# Altium project Armadeus.PrjPCB
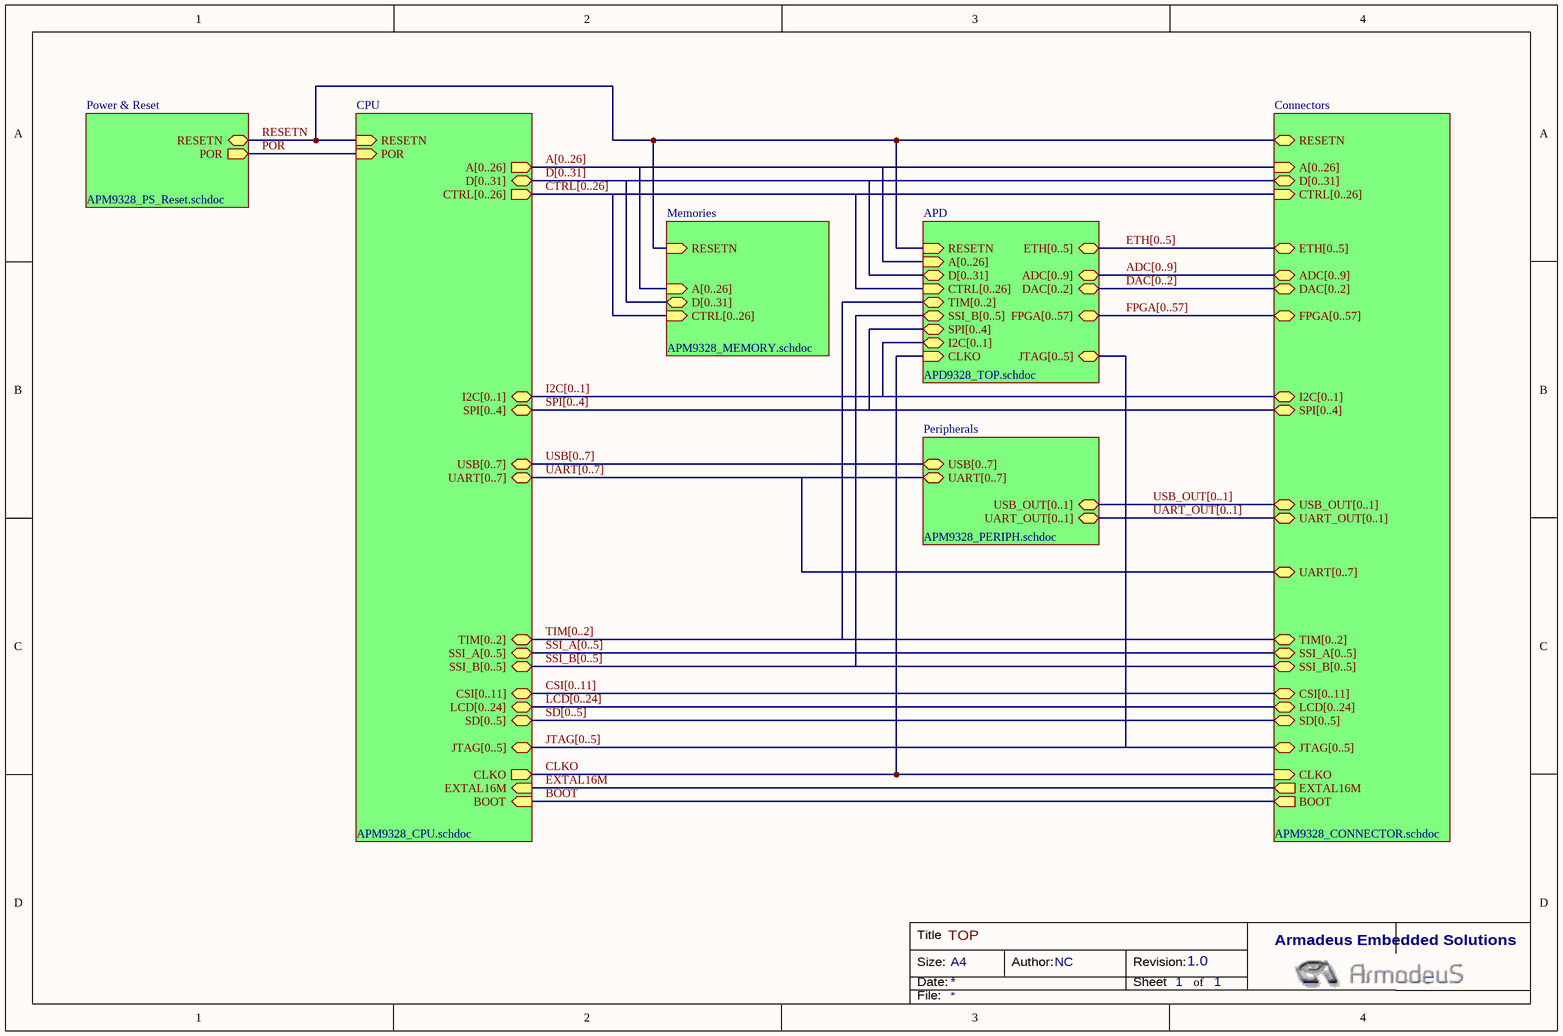
[diagram p0: APM9328_TOP.SchDoc]
10 sheets, 55 parts. Net scope: hierarchical (ports join the sheet entries above them; power ports are global).
Board file: Armadeus.PcbDoc
Sheets:
  APM9328_TOP.SchDoc
    Power & Reset = APM9328_PS_Reset.SchDoc
    CPU = APM9328_CPU.SchDoc
    Peripherals = APM9328_PERIPH.SchDoc
    Connectors = APM9328_CONNECTOR.SchDoc
      RIGHT_CONNECTOR = APM9328_CONNECTORR.SchDoc
      LEFT_CONNECTOR = APM9328_CONNECTORL.SchDoc
    APD = APD9328_TOP.SchDoc
      FPGA = APD9328_FPGA.SchDoc
      ANALOG = APD9328_ANALOG.SchDoc

## Sheet APM9328_TOP.SchDoc: TOP
size A4; Author: NC; Revision: 1.0; SheetNumber: 1; SheetTotal: 1

### Sub-sheets
APD = APD9328_TOP.schdoc: RESETN (in), A[0..26] (in), D[0..31] (bidir), CTRL[0..26] (in), ETH[0..5] (bidir), ADC[0..9] (bidir), DAC[0..2] (bidir), FPGA[0..57] (bidir), I2C[0..1] (bidir), SPI[0..4] (bidir), CLKO (in), SSI_B[0..5] (bidir), TIM[0..2] (bidir), JTAG[0..5] (bidir)
Connectors = APM9328_CONNECTOR.schdoc: UART[0..7] (bidir), UART_OUT[0..1] (bidir), USB_OUT[0..1] (bidir), A[0..26] (in), D[0..31] (bidir), CTRL[0..26] (in), TIM[0..2] (bidir), I2C[0..1] (bidir), SPI[0..4] (bidir), SSI_A[0..5] (bidir), SSI_B[0..5] (bidir), CSI[0..11] (bidir), LCD[0..24] (bidir), SD[0..5] (bidir), JTAG[0..5] (bidir), CLKO (in), EXTAL16M (out), BOOT (out), RESETN (bidir), ETH[0..5] (bidir), ADC[0..9] (bidir), DAC[0..2] (bidir), FPGA[0..57] (bidir)
CPU = APM9328_CPU.schdoc: A[0..26] (out), BOOT (in), CLKO (out), CSI[0..11] (bidir), CTRL[0..26] (out), D[0..31] (bidir), EXTAL16M (in), I2C[0..1] (bidir), JTAG[0..5] (bidir), LCD[0..24] (bidir), RESETN (in), POR (in), SD[0..5] (bidir), SPI[0..4] (bidir), SSI_A[0..5] (bidir), SSI_B[0..5] (bidir), TIM[0..2] (bidir), UART[0..7] (bidir), USB[0..7] (bidir)
Memories = APM9328_MEMORY.schdoc (file not in this document): A[0..26] (in), CTRL[0..26] (in), D[0..31] (bidir), RESETN (in)
Peripherals = APM9328_PERIPH.schdoc: UART[0..7] (bidir), UART_OUT[0..1] (bidir), USB[0..7] (bidir), USB_OUT[0..1] (bidir)
Power & Reset = APM9328_PS_Reset.schdoc: POR (out), RESETN (bidir)

### Nets
BOOT: sheet CPU/BOOT, sheet Connectors/BOOT
CLKO: sheet CPU/CLKO, sheet Connectors/CLKO, sheet APD/CLKO
EXTAL16M: sheet CPU/EXTAL16M, sheet Connectors/EXTAL16M
POR: sheet Power & Reset/POR, sheet CPU/POR
RESETN: sheet Power & Reset/RESETN, sheet CPU/RESETN, sheet Memories/RESETN, sheet Connectors/RESETN, sheet APD/RESETN

### Buses and harness runs
bus A[0..26] = sheet APD/A[0..26] = sheet Connectors/A[0..26] = sheet CPU/A[0..26] = sheet Memories/A[0..26]
bus ADC[0..9] = sheet APD/ADC[0..9] = sheet Connectors/ADC[0..9]
bus CSI[0..11] = sheet Connectors/CSI[0..11] = sheet CPU/CSI[0..11]
bus CTRL[0..26] = sheet APD/CTRL[0..26] = sheet Connectors/CTRL[0..26] = sheet CPU/CTRL[0..26] = sheet Memories/CTRL[0..26]
bus D[0..31] = sheet APD/D[0..31] = sheet Connectors/D[0..31] = sheet CPU/D[0..31] = sheet Memories/D[0..31]
bus DAC[0..2] = sheet APD/DAC[0..2] = sheet Connectors/DAC[0..2]
bus ETH[0..5] = sheet APD/ETH[0..5] = sheet Connectors/ETH[0..5]
bus FPGA[0..57] = sheet APD/FPGA[0..57] = sheet Connectors/FPGA[0..57]
bus I2C[0..1] = sheet APD/I2C[0..1] = sheet Connectors/I2C[0..1] = sheet CPU/I2C[0..1]
bus JTAG[0..5] = sheet APD/JTAG[0..5] = sheet Connectors/JTAG[0..5] = sheet CPU/JTAG[0..5]
bus LCD[0..24] = sheet Connectors/LCD[0..24] = sheet CPU/LCD[0..24]
bus SD[0..5] = sheet Connectors/SD[0..5] = sheet CPU/SD[0..5]
bus SPI[0..4] = sheet APD/SPI[0..4] = sheet Connectors/SPI[0..4] = sheet CPU/SPI[0..4]
bus SSI_A[0..5] = sheet Connectors/SSI_A[0..5] = sheet CPU/SSI_A[0..5]
bus SSI_B[0..5] = sheet APD/SSI_B[0..5] = sheet Connectors/SSI_B[0..5] = sheet CPU/SSI_B[0..5]
bus TIM[0..2] = sheet APD/TIM[0..2] = sheet Connectors/TIM[0..2] = sheet CPU/TIM[0..2]
bus UART[0..7] = sheet Connectors/UART[0..7] = sheet CPU/UART[0..7] = sheet Peripherals/UART[0..7]
bus UART_OUT[0..1] = sheet Connectors/UART_OUT[0..1] = sheet Peripherals/UART_OUT[0..1]
bus USB[0..7] = sheet CPU/USB[0..7] = sheet Peripherals/USB[0..7]
bus USB_OUT[0..1] = sheet Connectors/USB_OUT[0..1] = sheet Peripherals/USB_OUT[0..1]

### Notes on the sheet
- Title
- Size:
- Date:
- A4
- Author:
- Revision:
- Sheet
- of
- Armadeus Embedded Solutions
- File:

## Sheet APM9328_PS_Reset.SchDoc: POWER SUPPLY & RESET
size A4; Author: NC; Revision: 1.0; SheetNumber: 2; SheetTotal: 14
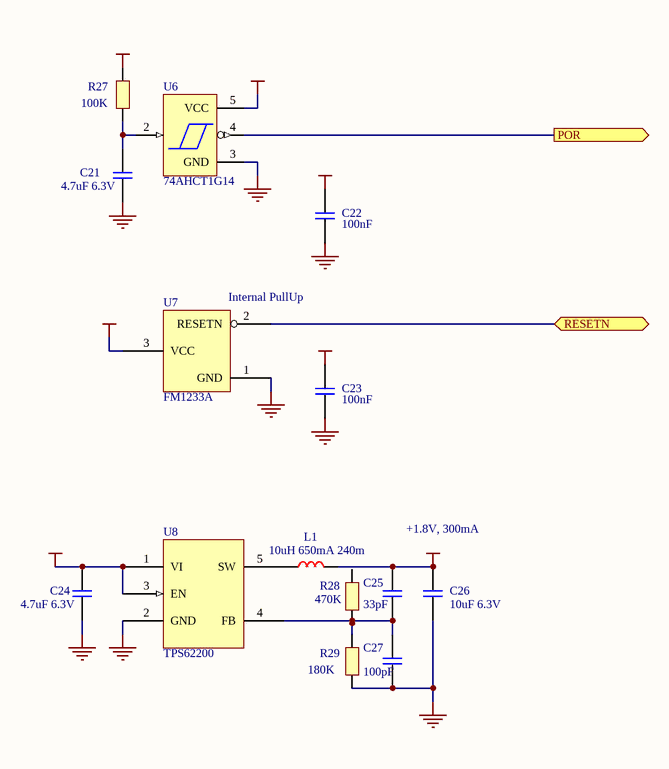
[diagram p1: APM9328_PS_Reset.SchDoc]

### Parts
C21  4.7uF 6.3V  [0805]
C22  100nF  [0402]
C23  100nF  [0402]
C24  4.7uF 6.3V  [0805]
C25  33pF  [0402]
C26  10uF 6.3V  [0805]
C27  100pF  [0402]
L1  10uH 650mA 240m  [Self_1812]
R27  100K  [0402]
R28  470K  [0402]
R29  180K  [0402]
U6  74AHCT1G14  [SC70-5]
U7  FM1233A  [SOT23-3]
U8  TPS62200  [SOT23-5]

### Ports
POR (out), RESETN (bidir)

### Nets
+1V8: C25.2 C26.2 L1.2
+3V3: C22.1 C23.1 C24.2 R27.2 U6.5(VCC) U7.3(VCC) U8.1(VI) U8.3(EN)
GND: C21.1 C22.2 C23.2 C24.1 C26.1 C27.1 R29.1 U6.3(GND) U7.1(GND) U8.2(GND)
POR: U6.4 ; port POR
RESETN: U7.2(RESETN) ; port RESETN
NetC21_2: C21.2 R27.1 U6.2
NetC25_1: C25.1 C27.2 R28.1 R29.2 U8.4(FB)
NetL1_1: L1.1 U8.5(SW)

Not connected (* = marked no-connect by the designer): R28 2; U6 1(NC)

### Notes on the sheet
- (near U7) Internal PullUp
- +1.8V, 300mA
- Title
- Size:
- Date:
- A4
- Author:
- Revision:
- Sheet
- of
- Armadeus Embedded Solutions
- File:

### Library data of the parts
C21 C24 = Cap: Ceramic Capacitor; Manufacturer: Kemet; Part Number: C0805C475K8PACTU; Distributor: Mouser
  C21: Price: *; Second Source: *; Assemby Option: *
  C24: Price_100: 0,3; Price_500: 0,11; Price_1000: 0,09
C22 C23 C25 C27 = Cap
C26 = Cap: Ceramic Capacitor; Manufacturer: *; Part Number: *; Distributor: *; Second Source: *; Price: *; Assembly Option: *
L1 = Self: Manufacturer: Murata; Part Number: LQH43CN100K03L; Distributor: Mouser; Price_100: 0,31; Price_500: 0,18; Price_1000: 0,17
R27 = Res: Manufacturer: KOA; Part Number: *; Distributor: Mouser; Price_100: 0,03; Price_500: 0,025; Price_1000: 0,02
R28 R29 = Res
U6 = 74AHCT1G14: Single Gate Inverter; Manufacturer: Texas Instrument; Part Number: SN74AHC1G14DCK; Second Source: NC7SV14 (Fairchild); Distributor: Digikey; Price_100: 0,216; Price_500: 0,126; Price_1000: 0,108
U7 = FM1233: Reset IC; Manufacturer: Fairchild; Part Number: FM1233ACS3X; Distributor: Mouser; Price_1000: 0,3; Price_500: 0,36; Price_100: 0,6
U8 = TPS62200: High Efficiency DC/DC converter; Manufacturer: Texas Instrument; Part Number: TPS62200DBV; Second Source: LM3670; Distributor: Digikey; Price_100: 1,68; Price_500: 1,56; Price_1000: 1,53

## Sheet APM9328_CPU.SchDoc
size A3; Organization: NetModule AG; Address1: Meriedweg 11; Address2: CH-3172 Niederwangen; Address4: Switzerland
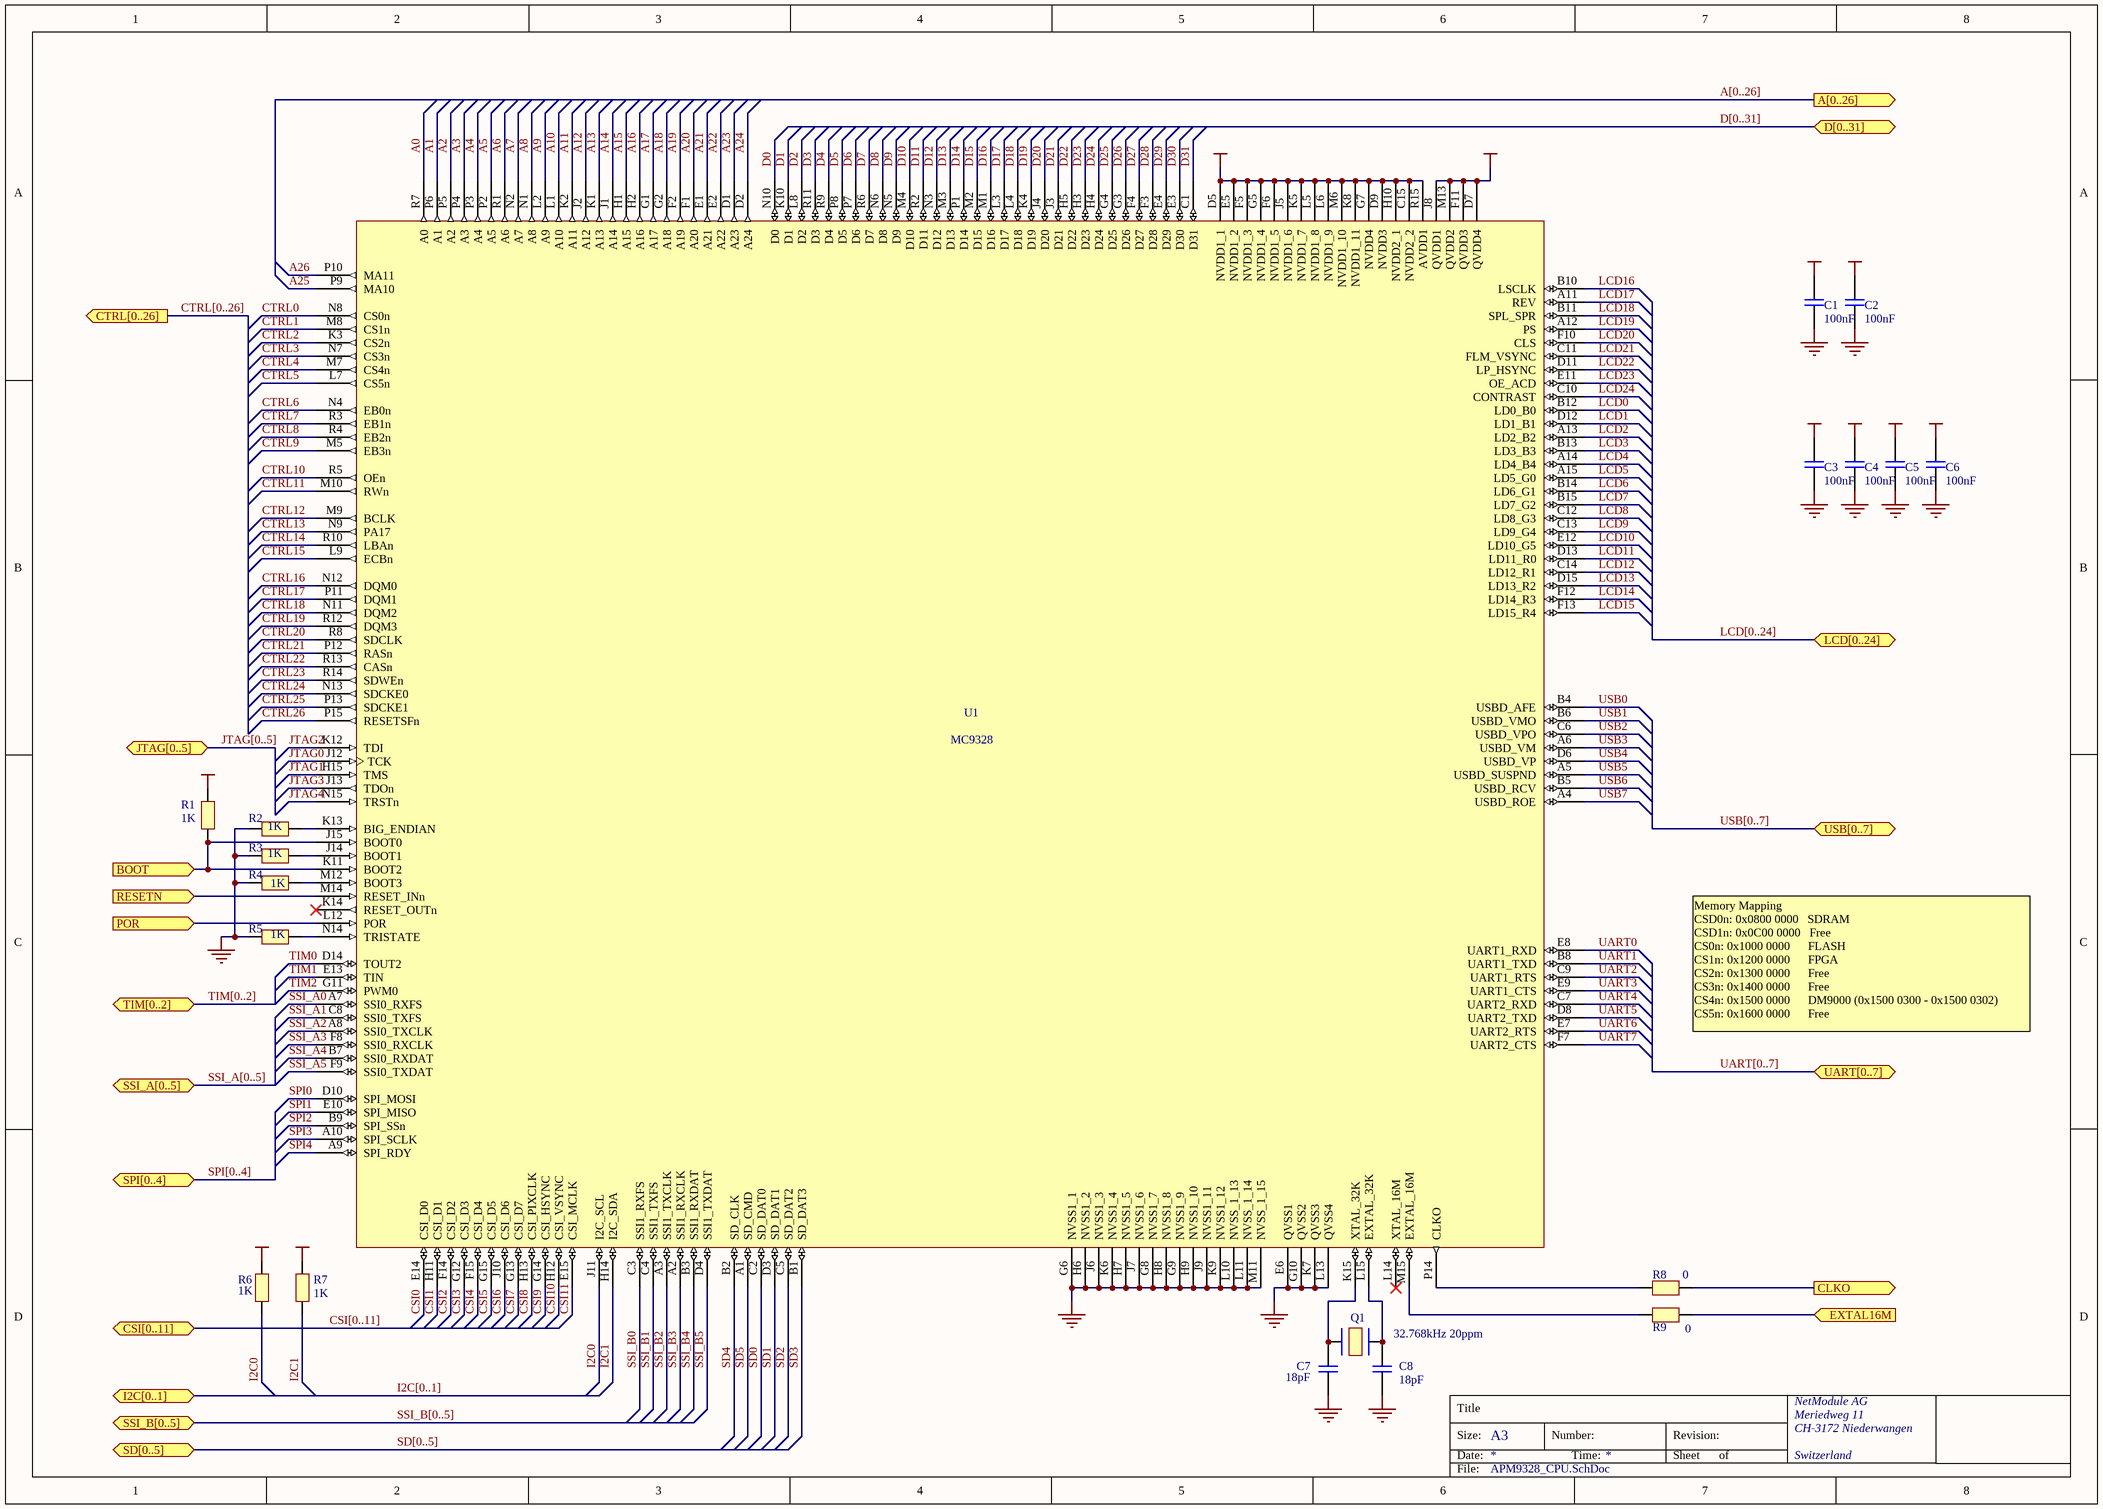
[diagram p2: APM9328_CPU.SchDoc]

### Parts
C1  100nF  [0402]
C2  100nF  [0402]
C3  100nF  [0402]
C4  100nF  [0402]
C5  100nF  [0402]
C6  100nF  [0402]
C7  18pF  [0402]
C8  18pF  [0402]
Q1  32.768kHz 20ppm  [Crystal_SMD_Cyl]
R1  1K  [0402]
R2  1K  [0402]
R3  1K  [0402]
R4  1K  [0402]
R5  1K  [0402]
R6  1K  [0402]
R7  1K  [0402]
R8  0  [0402]
R9  0  [0402]
U1  MC9328  [BGA225x15]

### Ports
A[0..26] (out), BOOT (in), CLKO (out), CSI[0..11] (bidir), CTRL[0..26] (out), D[0..31], EXTAL16M (in), I2C[0..1] (bidir), JTAG[0..5] (bidir), LCD[0..24] (bidir), POR (in), RESETN (in), SD[0..5], SPI[0..4], SSI_A[0..5] (bidir), SSI_B[0..5] (bidir), TIM[0..2], UART[0..7] (bidir), USB[0..7] (bidir)

### Nets
+1V8: C1.2 C2.2 U1.D7(QVDD4) U1.F11(QVDD3) U1.J8(QVDD1) U1.M13(QVDD2)
+3V3: C3.2 C4.2 C5.2 C6.2 R1.2 R6.2 R7.2 U1.C15(NVDD2_2) U1.D5(NVDD1_1) U1.D9(NVDD3) U1.E5(NVDD1_2) U1.F5(NVDD1_3) U1.F6(NVDD1_5) U1.G5(NVDD1_4) U1.G7(NVDD4) U1.H10(NVDD2_1) U1.J5(NVDD1_6) U1.K5(NVDD1_7) U1.K8(NVDD1_11) U1.L5(NVDD1_8) U1.L6(NVDD1_9) U1.M6(NVDD1_10) U1.R15(AVDD1)
GND: C1.1 C2.1 C3.1 C4.1 C5.1 C6.1 C7.1 C8.1 R2.1 R3.1 R4.1 R5.1 U1.E6(QVSS1) U1.G6(NVSS1_1) U1.G8(NVSS1_7) U1.G9(NVSS1_9) U1.G10(QVSS2) U1.H6(NVSS1_2) U1.H7(NVSS1_5) U1.H8(NVSS1_8) U1.H9(NVSS1_10) U1.J6(NVSS1_3) U1.J7(NVSS1_6) U1.J9(NVSS1_11) U1.K6(NVSS1_4) U1.K7(QVSS3) U1.K9(NVSS1_12) U1.L10(NVSS_1_13) U1.L11(NVSS_1_14) U1.L13(QVSS4) U1.M11(NVSS_1_15)
A0: U1.R7(A0)
A1: U1.P6(A1)
A2: U1.P5(A2)
A3: U1.P4(A3)
A4: U1.P3(A4)
A5: U1.P2(A5)
A6: U1.R1(A6)
A7: U1.N2(A7)
A8: U1.N1(A8)
A9: U1.L2(A9)
A10: U1.L1(A10)
A11: U1.K2(A11)
A12: U1.J2(A12)
A13: U1.K1(A13)
A14: U1.J1(A14)
A15: U1.H1(A15)
A16: U1.H2(A16)
A17: U1.G1(A17)
A18: U1.G2(A18)
A19: U1.F2(A19)
A20: U1.F1(A20)
A21: U1.E1(A21)
A22: U1.E2(A22)
A23: U1.D1(A23)
A24: U1.D2(A24)
A25: U1.P9(MA10)
A26: U1.P10(MA11)
BOOT: R1.1 U1.J15(BOOT0) U1.K11(BOOT2) ; port BOOT
CLKO: R8.2 ; port CLKO
CSI0: U1.E14(CSI_D0)
CSI1: U1.H11(CSI_D1)
CSI2: U1.F14(CSI_D2)
CSI3: U1.G12(CSI_D3)
CSI4: U1.F15(CSI_D4)
CSI5: U1.G15(CSI_D5)
CSI6: U1.J10(CSI_D6)
CSI7: U1.G13(CSI_D7)
CSI8: U1.H13(CSI_PIXCLK)
CSI9: U1.G14(CSI_HSYNC)
CSI10: U1.H12(CSI_VSYNC)
CSI11: U1.E15(CSI_MCLK)
CTRL0: U1.N8(CS0n)
CTRL1: U1.M8(CS1n)
CTRL2: U1.K3(CS2n)
CTRL3: U1.N7(CS3n)
CTRL4: U1.M7(CS4n)
CTRL5: U1.L7(CS5n)
CTRL6: U1.N4(EB0n)
CTRL7: U1.R3(EB1n)
CTRL8: U1.R4(EB2n)
CTRL9: U1.M5(EB3n)
CTRL10: U1.R5(OEn)
CTRL11: U1.M10(RWn)
CTRL12: U1.M9(BCLK)
CTRL13: U1.N9(PA17)
CTRL14: U1.R10(LBAn)
CTRL15: U1.L9(ECBn)
CTRL16: U1.N12(DQM0)
CTRL17: U1.P11(DQM1)
CTRL18: U1.N11(DQM2)
CTRL19: U1.R12(DQM3)
CTRL20: U1.R8(SDCLK)
CTRL21: U1.P12(RASn)
CTRL22: U1.R13(CASn)
CTRL23: U1.R14(SDWEn)
CTRL24: U1.N13(SDCKE0)
CTRL25: U1.P13(SDCKE1)
CTRL26: U1.P15(RESETSFn)
D0: U1.N10(D0)
D1: U1.K10(D1)
D2: U1.L8(D2)
D3: U1.R11(D3)
D4: U1.R9(D4)
D5: U1.P8(D5)
D6: U1.P7(D6)
D7: U1.R6(D7)
D8: U1.N6(D8)
D9: U1.N5(D9)
D10: U1.M4(D10)
D11: U1.R2(D11)
D12: U1.N3(D12)
D13: U1.M3(D13)
D14: U1.P1(D14)
D15: U1.M2(D15)
D16: U1.M1(D16)
D17: U1.L3(D17)
D18: U1.L4(D18)
D19: U1.K4(D19)
D20: U1.J4(D20)
D21: U1.J3(D21)
D22: U1.H5(D22)
D23: U1.H3(D23)
D24: U1.H4(D24)
D25: U1.G4(D25)
D26: U1.G3(D26)
D27: U1.F4(D27)
D28: U1.F3(D28)
D29: U1.E4(D29)
D30: U1.E3(D30)
D31: U1.C1(D31)
EXTAL16M: R9.2 ; port EXTAL16M
I2C0: R6.1 U1.J11(I2C_SCL)
I2C1: R7.1 U1.H14(I2C_SDA)
JTAG0: U1.J12(TCK)
JTAG1: U1.H15(TMS)
JTAG2: U1.K12(TDI)
JTAG3: U1.J13(TDOn)
JTAG4: U1.N15(TRSTn)
LCD0: U1.B12(LD0_B0)
LCD1: U1.D12(LD1_B1)
LCD2: U1.A13(LD2_B2)
LCD3: U1.B13(LD3_B3)
LCD4: U1.A14(LD4_B4)
LCD5: U1.A15(LD5_G0)
LCD6: U1.B14(LD6_G1)
LCD7: U1.B15(LD7_G2)
LCD8: U1.C12(LD8_G3)
LCD9: U1.C13(LD9_G4)
LCD10: U1.E12(LD10_G5)
LCD11: U1.D13(LD11_R0)
LCD12: U1.C14(LD12_R1)
LCD13: U1.D15(LD13_R2)
LCD14: U1.F12(LD14_R3)
LCD15: U1.F13(LD15_R4)
LCD16: U1.B10(LSCLK)
LCD17: U1.A11(REV)
LCD18: U1.B11(SPL_SPR)
LCD19: U1.A12(PS)
LCD20: U1.F10(CLS)
LCD21: U1.C11(FLM_VSYNC)
LCD22: U1.D11(LP_HSYNC)
LCD23: U1.E11(OE_ACD)
LCD24: U1.C10(CONTRAST)
POR: U1.L12(POR) ; port POR
RESETN: U1.M14(RESET_INn) ; port RESETN
SD0: U1.C2(SD_DAT0)
SD1: U1.D3(SD_DAT1)
SD2: U1.C5(SD_DAT2)
SD3: U1.B1(SD_DAT3)
SD4: U1.B2(SD_CLK)
SD5: U1.A1(SD_CMD)
SPI0: U1.D10(SPI_MOSI)
SPI1: U1.E10(SPI_MISO)
SPI2: U1.B9(SPI_SSn)
SPI3: U1.A10(SPI_SCLK)
SPI4: U1.A9(SPI_RDY)
SSI_A0: U1.A7(SSI0_RXFS)
SSI_A1: U1.C8(SSI0_TXFS)
SSI_A2: U1.A8(SSI0_TXCLK)
SSI_A3: U1.F8(SSI0_RXCLK)
SSI_A4: U1.B7(SSI0_RXDAT)
SSI_A5: U1.F9(SSI0_TXDAT)
SSI_B0: U1.C3(SSI1_RXFS)
SSI_B1: U1.C4(SSI1_TXFS)
SSI_B2: U1.A3(SSI1_TXCLK)
SSI_B3: U1.A2(SSI1_RXCLK)
SSI_B4: U1.B3(SSI1_RXDAT)
SSI_B5: U1.D4(SSI1_TXDAT)
TIM0: U1.D14(TOUT2)
TIM1: U1.E13(TIN)
TIM2: U1.G11(PWM0)
UART0: U1.E8(UART1_RXD)
UART1: U1.B8(UART1_TXD)
UART2: U1.C9(UART1_RTS)
UART3: U1.E9(UART1_CTS)
UART4: U1.C7(UART2_RXD)
UART5: U1.D8(UART2_TXD)
UART6: U1.E7(UART2_RTS)
UART7: U1.F7(UART2_CTS)
USB0: U1.B4(USBD_AFE)
USB1: U1.B6(USBD_VMO)
USB2: U1.C6(USBD_VPO)
USB3: U1.A6(USBD_VM)
USB4: U1.D6(USBD_VP)
USB5: U1.A5(USBD_SUSPND)
USB6: U1.B5(USBD_RCV)
USB7: U1.A4(USBD_ROE)
NetC7_2: C7.2 Q1.1 U1.K15(XTAL_32K)
NetC8_2: C8.2 Q1.2 U1.L15(EXTAL_32K)
NetR2_2: R2.2 U1.K13(BIG_ENDIAN)
NetR3_2: R3.2 U1.J14(BOOT1)
NetR4_2: R4.2 U1.M12(BOOT3)
NetR5_2: R5.2 U1.N14(TRISTATE)
NetR8_1: R8.1 U1.P14(CLKO)
NetR9_1: R9.1 U1.M15(EXTAL_16M)

Not connected (* = marked no-connect by the designer): U1 K14(RESET_OUTn)* L14(XTAL_16M)*

### Buses and harness runs
bus A[0..26] = port A[0..26]
bus CSI[0..11] = port CSI[0..11]
bus CTRL[0..26] = port CTRL[0..26]
bus D[0..31] = port D[0..31]
bus I2C[0..1] = port I2C[0..1]
bus JTAG[0..5] = port JTAG[0..5]
bus LCD[0..24] = port LCD[0..24]
bus SD[0..5] = port SD[0..5]
bus SPI[0..4] = port SPI[0..4]
bus SSI_A[0..5] = port SSI_A[0..5]
bus SSI_B[0..5] = port SSI_B[0..5]
bus TIM[0..2] = port TIM[0..2]
bus UART[0..7] = port UART[0..7]
bus USB[0..7] = port USB[0..7]

### Notes on the sheet
- Memory Mapping
  CSD0n: 0x0800 0000   SDRAM
  CSD1n: 0x0C00 0000   Free
  CS0n: 0x1000 0000      FLASH
  CS1n: 0x1200 0000      FPGA
  CS2n: 0x1300 0000      Free
  CS3n: 0x1400 0000      Free
  CS4n: 0x1500 0000      DM9000 (0x1500 0300 - 0x1500 0302)
  CS5n: 0x1600 0000      Free
- Title
- Size:
- Date:
- A3
- Number:
- Time:
- Revision:
- Sheet
- of
- File:

### Library data of the parts
C1-C8 = Cap
Q1 = QUARTZ: Manufacturer: Citizen; Part Number: CMR200TB32.768KDZFTR; Distributor: Digikey; Second Source: *; Price_100: 0,4; Price_500: 0,33; Price_1000: 0,3
R1-R9 = Res
U1 = MC9328MXL: Manufacturer: Freescale; Part Number: *; Distributor: *; Price_100: *; Assembly Option: *

## Sheet APM9328_PERIPH.SchDoc: UART & USB
size A4; Author: NC; Revision: 1.0; SheetNumber: 5; SheetTotal: 14
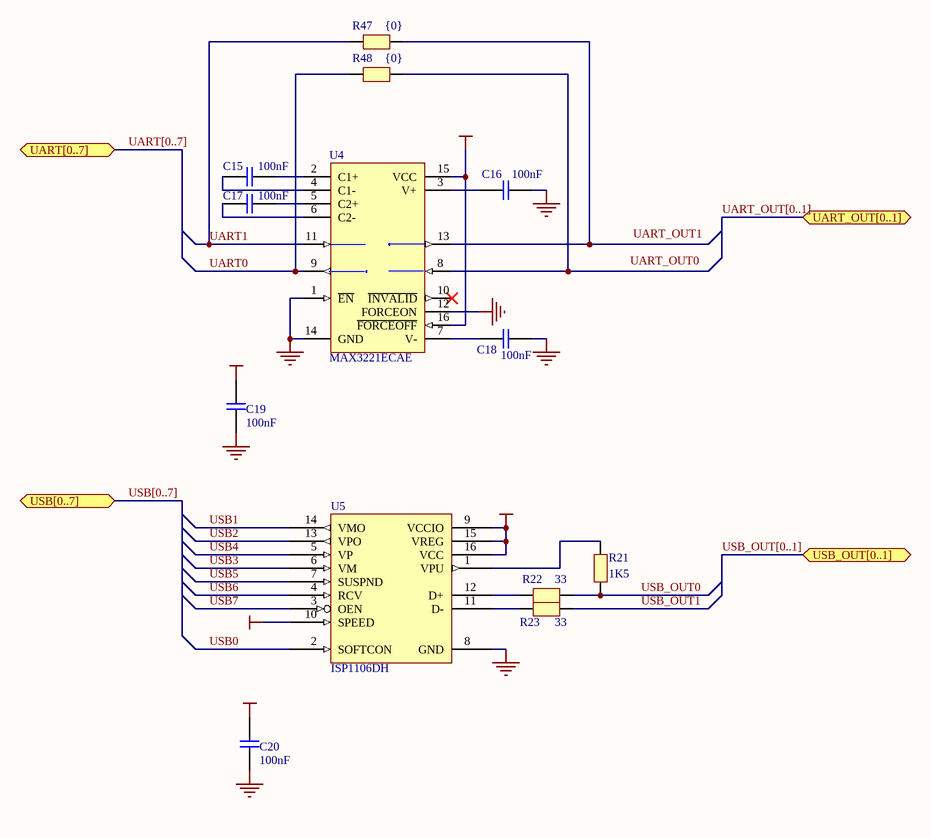
[diagram p3: APM9328_PERIPH.SchDoc]

### Parts
C15  100nF  [0402]
C16  100nF  [0402]
C17  100nF  [0402]
C18  100nF  [0402]
C19  100nF  [0402]
C20  100nF  [0402]
R21  1K5  [0402]
R22  33  [0402]
R23  33  [0402]
R47  {0}  [0402]
R48  {0}  [0402]
U4  MAX3221ECAE  [TSSOP16]
U5  ISP1106DH  [TSSOP16]

### Ports
UART[0..7] (bidir), UART_OUT[0..1] (bidir), USB[0..7] (bidir), USB_OUT[0..1] (bidir)

### Nets
+3V3: C19.1 C20.1 U4.15(VCC) U4.16(~{FORCEOFF}) U5.9(VCCIO) U5.10(SPEED) U5.15(VREG) U5.16(VCC)
GND: C16.2 C18.2 C19.2 C20.2 U4.1(~{EN}) U4.12(FORCEON) U4.14(GND) U5.8(GND)
UART0: R48.1 U4.9(R1OUT)
UART1: R47.1 U4.11(T1IN)
USB0: U5.2(SOFTCON)
USB1: U5.14(VMO)
USB2: U5.13(VPO)
USB3: U5.6(VM)
USB4: U5.5(VP)
USB5: U5.7(SUSPND)
USB6: U5.4(RCV)
USB7: U5.3(OEN)
USB_OUT0: R21.1 R22.2
USB_OUT1: R23.2
NetC15_1: C15.1 U4.4(C1-)
NetC15_2: C15.2 U4.2(C1+)
NetC16_1: C16.1 U4.3(V+)
NetC17_1: C17.1 U4.6(C2-)
NetC17_2: C17.2 U4.5(C2+)
NetC18_1: C18.1 U4.7(V-)
NetR21_2: R21.2 U5.1(VPU)
NetR22_1: R22.1 U5.12(D+)
NetR23_1: R23.1 U5.11(D-)
NetR47_2: R47.2 U4.13(T1OUT)
NetR48_2: R48.2 U4.8(R1IN)

Not connected (* = marked no-connect by the designer): U4 10(~{INVALID})*

### Buses and harness runs
bus UART[0..7] = port UART[0..7]
bus UART_OUT[0..1] = port UART_OUT[0..1]
bus USB[0..7] = port USB[0..7]
bus USB_OUT[0..1] = port USB_OUT[0..1]

### Notes on the sheet
- Labels drawn without touching a wire or pin: UART_OUT0, UART_OUT1
- Title
- Size:
- Date:
- A4
- Author:
- Revision:
- Sheet
- of
- Armadeus Embedded Solutions
- File:

### Library data of the parts
C15-C20 = Cap
R21-R23 R47 R48 = Res
U4 = MAX3221ECAE: ±15kV ESD-Protected, 1µA, 3.0V/5.5V, 250kbps, RS-232 Transceiver with AutoShutdown; Manufacturer: Texas Instrument; Part Number: MAX3221CPWR; PackageDocument: 1996; Published: 16-Jan-2001; LatestRevisionDate: 17-Jul-2002; LatestRevisionNote: Re-released for DXP Platform.; DatasheetDocument: Jan-1998; PackageReference: SSOP16; Publisher: Altium Limited; Distributor: Digikey; Price_100: 0,75; Price_500: 0,675; Price_1000: 0,65
U5 = ISP1106: USB 1.1 transceiver; Manufacturer: Philips; Part Number: ISP1106DH; Distributor: Avnet; Price_100: 0,594; Price_500: 0,48; Price_1000: 0,47

## Sheet APM9328_CONNECTOR.SchDoc: CONNECTOR TOP
size A4; Author: NC; Revision: 1.0; SheetNumber: 6; SheetTotal: 14
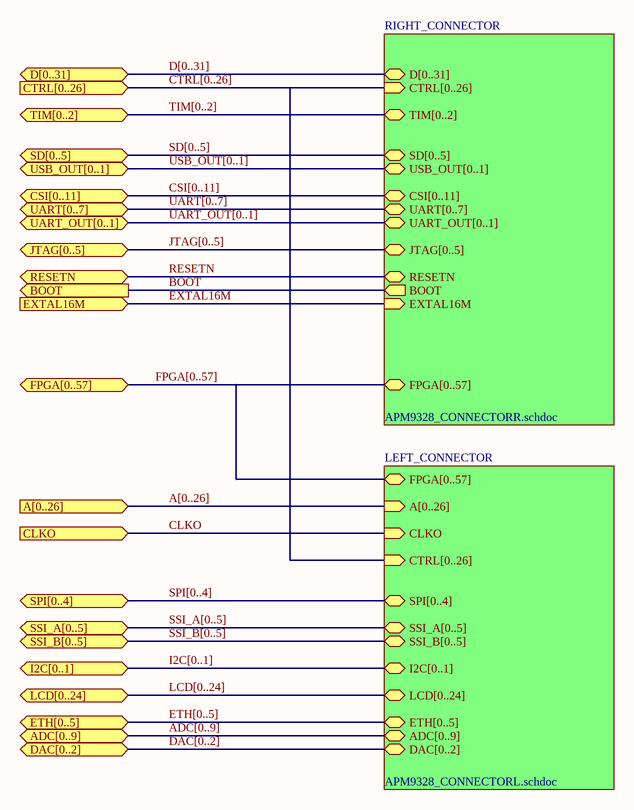
[diagram p4: APM9328_CONNECTOR.SchDoc]

### Sub-sheets
LEFT_CONNECTOR = APM9328_CONNECTORL.schdoc: A[0..26] (in), LCD[0..24] (bidir), SSI_B[0..5] (bidir), SPI[0..4] (bidir), SSI_A[0..5] (bidir), FPGA[0..57] (bidir), ETH[0..5] (bidir), ADC[0..9] (bidir), DAC[0..2] (bidir), I2C[0..1] (bidir), CLKO (in), CTRL[0..26] (in)
RIGHT_CONNECTOR = APM9328_CONNECTORR.schdoc: BOOT (out), USB_OUT[0..1] (bidir), CTRL[0..26] (in), D[0..31] (bidir), EXTAL16M (in), JTAG[0..5] (bidir), TIM[0..2] (bidir), CSI[0..11] (bidir), UART[0..7] (bidir), UART_OUT[0..1] (bidir), SD[0..5] (bidir), RESETN (bidir), FPGA[0..57] (bidir)

### Ports
A[0..26] (in), ADC[0..9] (bidir), BOOT (out), CLKO (in), CSI[0..11] (bidir), CTRL[0..26] (in), D[0..31] (bidir), DAC[0..2] (bidir), ETH[0..5] (bidir), EXTAL16M (in), FPGA[0..57] (bidir), I2C[0..1] (bidir), JTAG[0..5] (bidir), LCD[0..24] (bidir), RESETN (bidir), SD[0..5] (bidir), SPI[0..4] (bidir), SSI_A[0..5] (bidir), SSI_B[0..5] (bidir), TIM[0..2] (bidir), UART[0..7] (bidir), UART_OUT[0..1] (bidir), USB_OUT[0..1] (bidir)

### Nets
BOOT: port BOOT, sheet RIGHT_CONNECTOR/BOOT
CLKO: port CLKO, sheet LEFT_CONNECTOR/CLKO
EXTAL16M: port EXTAL16M, sheet RIGHT_CONNECTOR/EXTAL16M
RESETN: port RESETN, sheet RIGHT_CONNECTOR/RESETN

### Buses and harness runs
bus A[0..26] = port A[0..26] = sheet LEFT_CONNECTOR/A[0..26]
bus ADC[0..9] = port ADC[0..9] = sheet LEFT_CONNECTOR/ADC[0..9]
bus CSI[0..11] = port CSI[0..11] = sheet RIGHT_CONNECTOR/CSI[0..11]
bus CTRL[0..26] = port CTRL[0..26] = sheet LEFT_CONNECTOR/CTRL[0..26] = sheet RIGHT_CONNECTOR/CTRL[0..26]
bus D[0..31] = port D[0..31] = sheet RIGHT_CONNECTOR/D[0..31]
bus DAC[0..2] = port DAC[0..2] = sheet LEFT_CONNECTOR/DAC[0..2]
bus ETH[0..5] = port ETH[0..5] = sheet LEFT_CONNECTOR/ETH[0..5]
bus FPGA[0..57] = port FPGA[0..57] = sheet LEFT_CONNECTOR/FPGA[0..57] = sheet RIGHT_CONNECTOR/FPGA[0..57]
bus I2C[0..1] = port I2C[0..1] = sheet LEFT_CONNECTOR/I2C[0..1]
bus JTAG[0..5] = port JTAG[0..5] = sheet RIGHT_CONNECTOR/JTAG[0..5]
bus LCD[0..24] = port LCD[0..24] = sheet LEFT_CONNECTOR/LCD[0..24]
bus SD[0..5] = port SD[0..5] = sheet RIGHT_CONNECTOR/SD[0..5]
bus SPI[0..4] = port SPI[0..4] = sheet LEFT_CONNECTOR/SPI[0..4]
bus SSI_A[0..5] = port SSI_A[0..5] = sheet LEFT_CONNECTOR/SSI_A[0..5]
bus SSI_B[0..5] = port SSI_B[0..5] = sheet LEFT_CONNECTOR/SSI_B[0..5]
bus TIM[0..2] = port TIM[0..2] = sheet RIGHT_CONNECTOR/TIM[0..2]
bus UART[0..7] = port UART[0..7] = sheet RIGHT_CONNECTOR/UART[0..7]
bus UART_OUT[0..1] = port UART_OUT[0..1] = sheet RIGHT_CONNECTOR/UART_OUT[0..1]
bus USB_OUT[0..1] = port USB_OUT[0..1] = sheet RIGHT_CONNECTOR/USB_OUT[0..1]

### Notes on the sheet
- Title
- Size:
- Date:
- A4
- Author:
- Revision:
- Sheet
- of
- Armadeus Embedded Solutions
- File:

## Sheet APM9328_CONNECTORR.SchDoc: CONNECTOR R
size A4; Author: R; Revision: 1.0; SheetNumber: 8; SheetTotal: 14
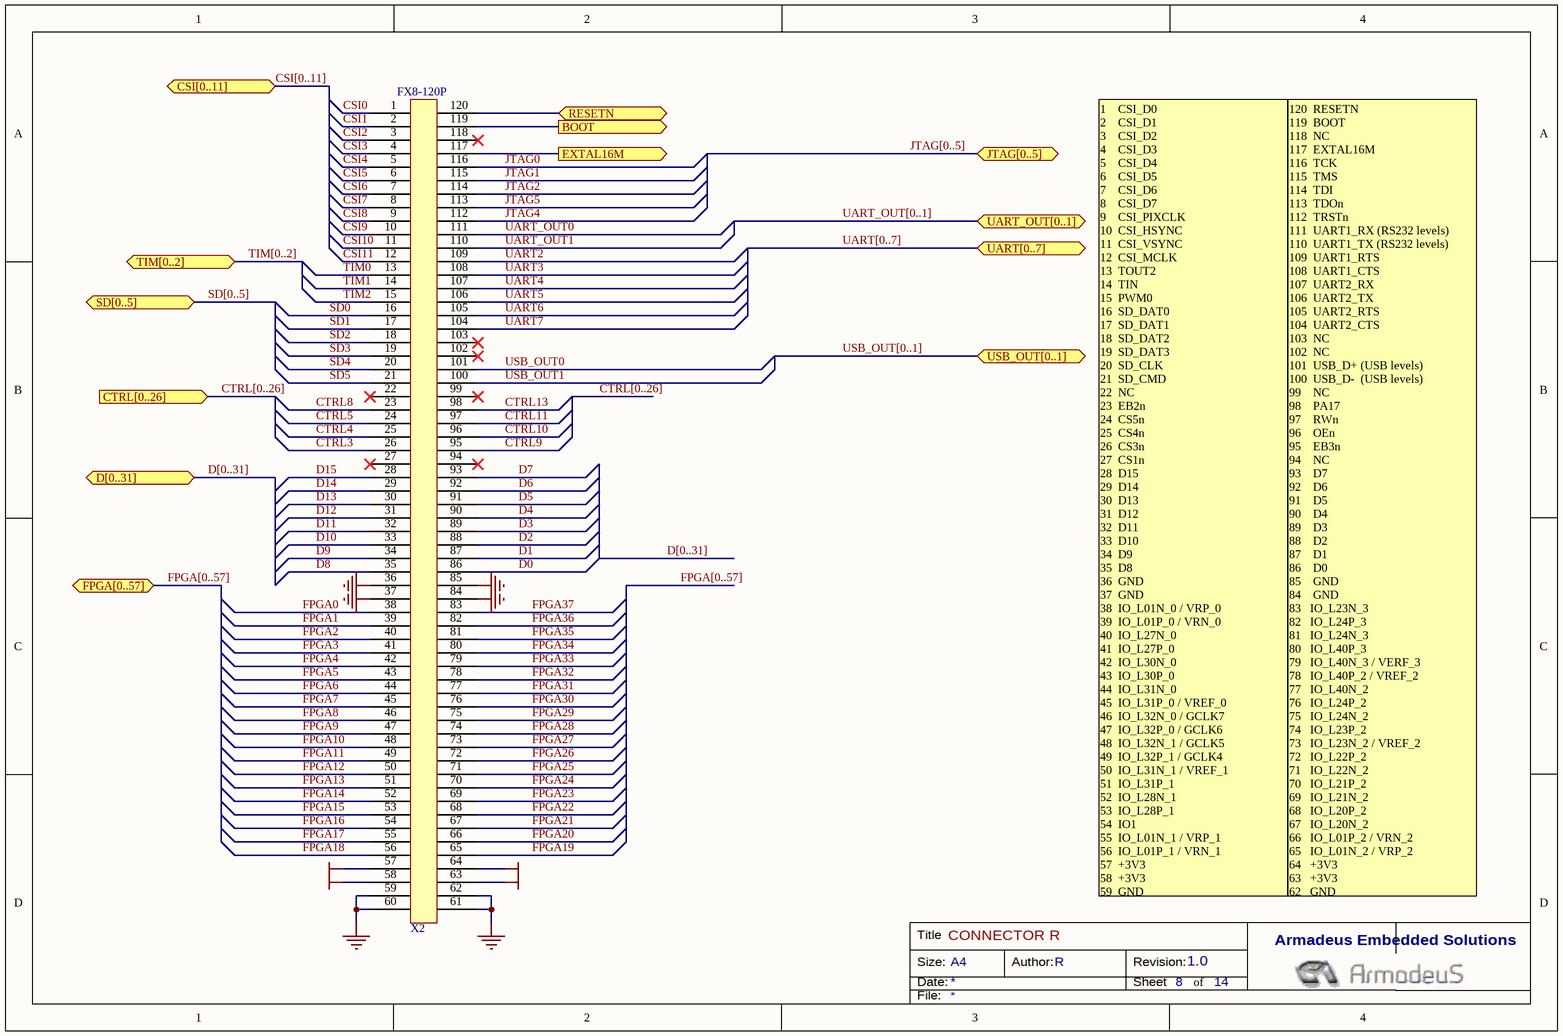
[diagram p5: APM9328_CONNECTORR.SchDoc]

### Parts
X2  FX8-120P  [FX8-120P]

### Ports
BOOT (out), CSI[0..11] (bidir), CTRL[0..26] (in), D[0..31] (bidir), EXTAL16M (out), FPGA[0..57] (bidir), JTAG[0..5] (bidir), RESETN (bidir), SD[0..5] (bidir), TIM[0..2] (bidir), UART[0..7] (bidir), UART_OUT[0..1] (bidir), USB_OUT[0..1] (bidir)

### Nets
+3V3: X2.57 X2.58 X2.63 X2.64
GND: X2.36 X2.37 X2.59 X2.60 X2.61 X2.62 X2.84 X2.85
BOOT: X2.119 ; port BOOT
CSI0: X2.1
CSI1: X2.2
CSI2: X2.3
CSI3: X2.4
CSI4: X2.5
CSI5: X2.6
CSI6: X2.7
CSI7: X2.8
CSI8: X2.9
CSI9: X2.10
CSI10: X2.11
CSI11: X2.12
CTRL3: X2.26
CTRL4: X2.25
CTRL5: X2.24
CTRL8: X2.23
CTRL9: X2.95
CTRL10: X2.96
CTRL11: X2.97
CTRL13: X2.98
D0: X2.86
D1: X2.87
D2: X2.88
D3: X2.89
D4: X2.90
D5: X2.91
D6: X2.92
D7: X2.93
D8: X2.35
D9: X2.34
D10: X2.33
D11: X2.32
D12: X2.31
D13: X2.30
D14: X2.29
D15: X2.28
EXTAL16M: X2.117 ; port EXTAL16M
FPGA0: X2.38
FPGA1: X2.39
FPGA2: X2.40
FPGA3: X2.41
FPGA4: X2.42
FPGA5: X2.43
FPGA6: X2.44
FPGA7: X2.45
FPGA8: X2.46
FPGA9: X2.47
FPGA10: X2.48
FPGA11: X2.49
FPGA12: X2.50
FPGA13: X2.51
FPGA14: X2.52
FPGA15: X2.53
FPGA16: X2.54
FPGA17: X2.55
FPGA18: X2.56
FPGA19: X2.65
FPGA20: X2.66
FPGA21: X2.67
FPGA22: X2.68
FPGA23: X2.69
FPGA24: X2.70
FPGA25: X2.71
FPGA26: X2.72
FPGA27: X2.73
FPGA28: X2.74
FPGA29: X2.75
FPGA30: X2.76
FPGA31: X2.77
FPGA32: X2.78
FPGA33: X2.79
FPGA34: X2.80
FPGA35: X2.81
FPGA36: X2.82
FPGA37: X2.83
JTAG0: X2.116
JTAG1: X2.115
JTAG2: X2.114
JTAG4: X2.112
JTAG5: X2.113
RESETN: X2.120 ; port RESETN
SD0: X2.16
SD1: X2.17
SD2: X2.18
SD3: X2.19
SD4: X2.20
SD5: X2.21
TIM0: X2.13
TIM1: X2.14
TIM2: X2.15
UART2: X2.109
UART3: X2.108
UART4: X2.107
UART5: X2.106
UART6: X2.105
UART7: X2.104
UART_OUT0: X2.111
UART_OUT1: X2.110
USB_OUT0: X2.101
USB_OUT1: X2.100

Not connected (* = marked no-connect by the designer): X2 22* 27* 94* 99* 102* 103* 118*

### Buses and harness runs
bus CSI[0..11] = port CSI[0..11]
bus CTRL[0..26]
bus CTRL[0..26] = port CTRL[0..26]
bus D[0..31]
bus D[0..31] = port D[0..31]
bus FPGA[0..57]
bus FPGA[0..57] = port FPGA[0..57]
bus JTAG[0..5] = port JTAG[0..5]
bus SD[0..5] = port SD[0..5]
bus TIM[0..2] = port TIM[0..2]
bus UART[0..7] = port UART[0..7]
bus UART_OUT[0..1] = port UART_OUT[0..1]
bus USB_OUT[0..1] = port USB_OUT[0..1]

### Notes on the sheet
- 1    CSI_D0
  2    CSI_D1
  3    CSI_D2
  4    CSI_D3
  5    CSI_D4
  6    CSI_D5
  7    CSI_D6
  8    CSI_D7
  9    CSI_PIXCLK
  10  CSI_HSYNC
  11  CSI_VSYNC
  12  CSI_MCLK
  13  TOUT2
  14  TIN
  15  PWM0
  16  SD_DAT0
  17  SD_DAT1
  18  SD_DAT2
  19  SD_DAT3
  20  SD_CLK
  21  SD_CMD
  22  NC
  23  EB2n
  24  CS5n
  25  CS4n
  26  CS3n
  27  CS1n
  28  D15
  29  D14
  30  D13
  31  D12
  32  D11
  33  D10
  34  D9
  35  D8
  36  GND
  37  GND
  38  IO_L01N_0 / VRP_0
  39  IO_L01P_0 / VRN_0
  40  IO_L27N_0
  41  IO_L27P_0
  42  IO_L30N_0
  43  IO_L30P_0
  44  IO_L31N_0
  45  IO_L31P_0 / VREF_0
  46  IO_L32N_0 / GCLK7
  47  IO_L32P_0 / GCLK6
  48  IO_L32N_1 / GCLK5
  49  IO_L32P_1 / GCLK4
  50  IO_L31N_1 / VREF_1
  51  IO_L31P_1
  52  IO_L28N_1
  53  IO_L28P_1
  54  IO1
  55  IO_L01N_1 / VRP_1
  56  IO_L01P_1 / VRN_1
  57  +3V3
  58  +3V3
  59  GND
  60  GND
- 120  RESETN
  119  BOOT
  118  NC
  117  EXTAL16M
  116  TCK
  115  TMS
  114  TDI
  113  TDOn
  112  TRSTn
  111  UART1_RX (RS232 levels)
  110  UART1_TX (RS232 levels)
  109  UART1_RTS
  108  UART1_CTS
  107  UART2_RX
  106  UART2_TX
  105  UART2_RTS
  104  UART2_CTS
  103  NC
  102  NC
  101  USB_D+ (USB levels)
  100  USB_D-  (USB levels)
  99    NC
  98    PA17
  97    RWn
  96    OEn
  95    EB3n
  94    NC
  93    D7
  92    D6
  91    D5
  90    D4
  89    D3
  88    D2
  87    D1
  86    D0
  85    GND
  84    GND
  83   IO_L23N_3
  82   IO_L24P_3
  81   IO_L24N_3
  80   IO_L40P_3
  79   IO_L40N_3 / VERF_3
  78   IO_L40P_2 / VREF_2
  77   IO_L40N_2
  76   IO_L24P_2
  75   IO_L24N_2
  74   IO_L23P_2
  73   IO_L23N_2 / VREF_2
  72   IO_L22P_2
  71   IO_L22N_2
  70   IO_L21P_2
  69   IO_L21N_2
  68   IO_L20P_2
  67   IO_L20N_2
  66   IO_L01P_2 / VRN_2
  65   IO_L01N_2 / VRP_2
  64   +3V3
  63   +3V3
  62   GND
  61   GND
- Title
- Size:
- Date:
- A4
- Author:
- Revision:
- Sheet
- of
- Armadeus Embedded Solutions
- File:

### Library data of the parts
X2 = FX8-120P: Fine Pitch Connector; Manufacturer: Hirose; Part Number: FX8-120P-SV; Distributor: Digikey; Price_100: 2,25; Price_500: 1,688; Price_1000: 1,63

## Sheet APM9328_CONNECTORL.SchDoc: CONNECTOR L
size A4; Author: NC; Revision: 1.0; SheetNumber: 7; SheetTotal: 14
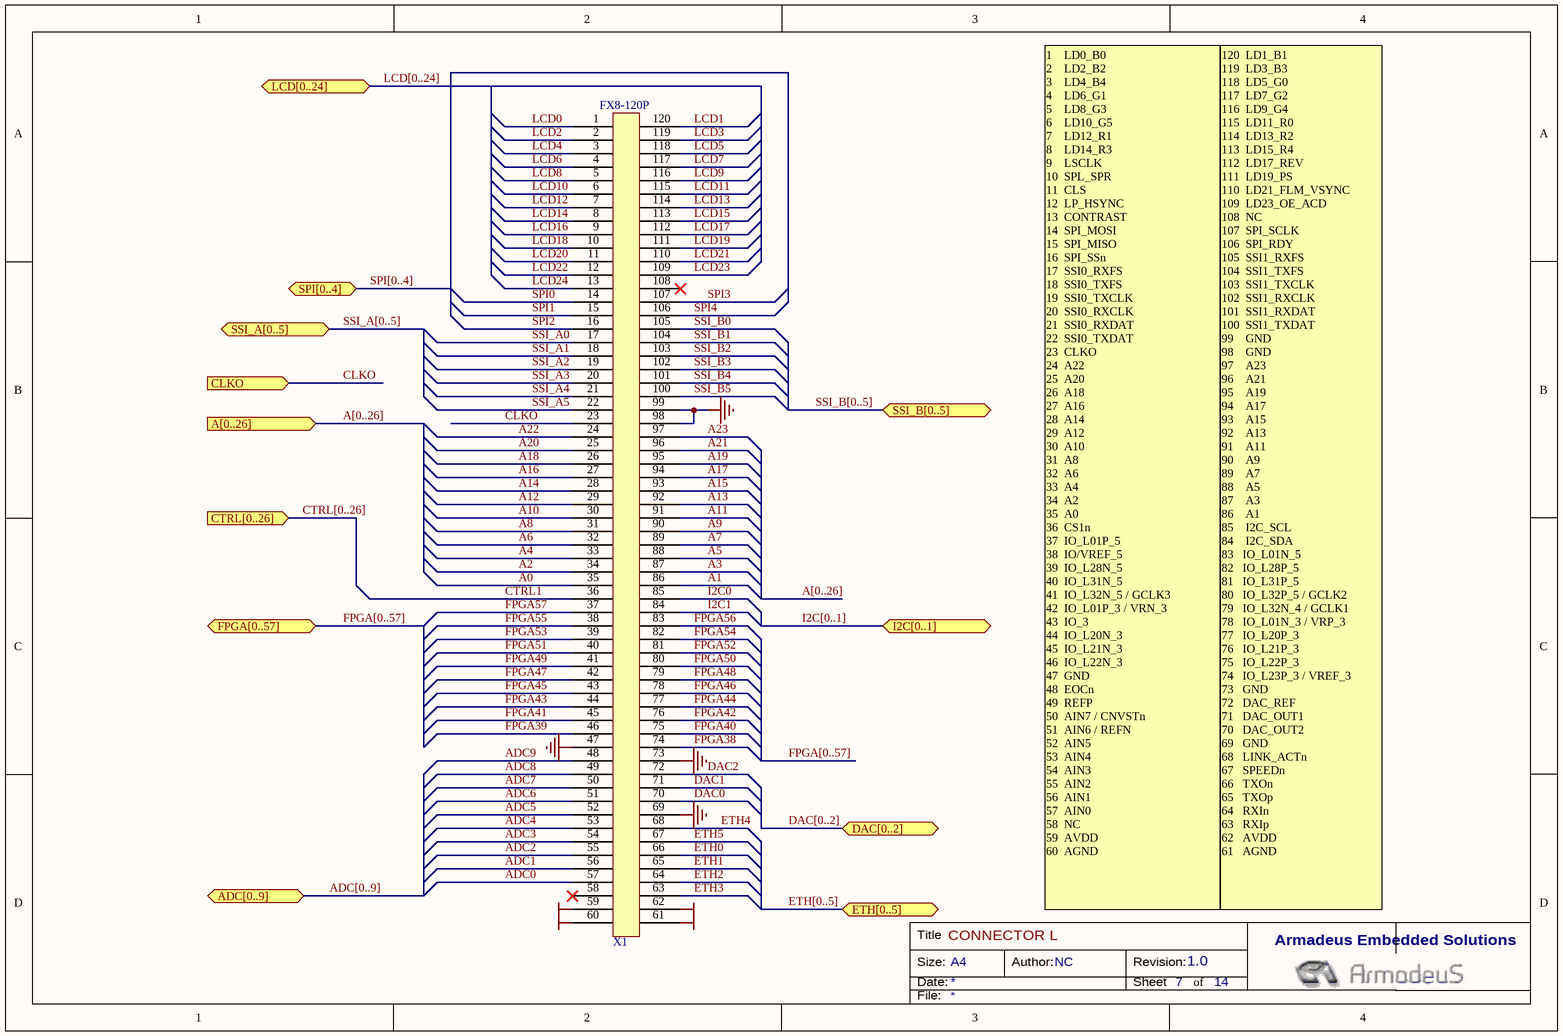
[diagram p6: APM9328_CONNECTORL.SchDoc]

### Parts
X1  FX8-120P  [FX8-120P]

### Ports
A[0..26] (in), ADC[0..9] (bidir), CLKO (in), CTRL[0..26] (in), DAC[0..2] (bidir), ETH[0..5] (bidir), FPGA[0..57] (bidir), I2C[0..1] (bidir), LCD[0..24] (bidir), SPI[0..4] (bidir), SSI_A[0..5] (bidir), SSI_B[0..5] (bidir)

### Nets
AGND: X1.60 X1.61
AVDD: X1.59 X1.62
GND: X1.47 X1.69 X1.73 X1.98 X1.99
A0: X1.35
A1: X1.86
A2: X1.34
A3: X1.87
A4: X1.33
A5: X1.88
A6: X1.32
A7: X1.89
A8: X1.31
A9: X1.90
A10: X1.30
A11: X1.91
A12: X1.29
A13: X1.92
A14: X1.28
A15: X1.93
A16: X1.27
A17: X1.94
A18: X1.26
A19: X1.95
A20: X1.25
A21: X1.96
A22: X1.24
A23: X1.97
ADC0: X1.57
ADC1: X1.56
ADC2: X1.55
ADC3: X1.54
ADC4: X1.53
ADC5: X1.52
ADC6: X1.51
ADC7: X1.50
ADC8: X1.49
ADC9: X1.48
CLKO: X1.23 ; port CLKO
CTRL1: X1.36
DAC0: X1.70
DAC1: X1.71
DAC2: X1.72
ETH0: X1.66
ETH1: X1.65
ETH2: X1.64
ETH3: X1.63
ETH4: X1.68
ETH5: X1.67
FPGA38: X1.74
FPGA39: X1.46
FPGA40: X1.75
FPGA41: X1.45
FPGA42: X1.76
FPGA43: X1.44
FPGA44: X1.77
FPGA45: X1.43
FPGA46: X1.78
FPGA47: X1.42
FPGA48: X1.79
FPGA49: X1.41
FPGA50: X1.80
FPGA51: X1.40
FPGA52: X1.81
FPGA53: X1.39
FPGA54: X1.82
FPGA55: X1.38
FPGA56: X1.83
FPGA57: X1.37
I2C0: X1.85
I2C1: X1.84
LCD0: X1.1
LCD1: X1.120
LCD2: X1.2
LCD3: X1.119
LCD4: X1.3
LCD5: X1.118
LCD6: X1.4
LCD7: X1.117
LCD8: X1.5
LCD9: X1.116
LCD10: X1.6
LCD11: X1.115
LCD12: X1.7
LCD13: X1.114
LCD14: X1.8
LCD15: X1.113
LCD16: X1.9
LCD17: X1.112
LCD18: X1.10
LCD19: X1.111
LCD20: X1.11
LCD21: X1.110
LCD22: X1.12
LCD23: X1.109
LCD24: X1.13
SPI0: X1.14
SPI1: X1.15
SPI2: X1.16
SPI3: X1.107
SPI4: X1.106
SSI_A0: X1.17
SSI_A1: X1.18
SSI_A2: X1.19
SSI_A3: X1.20
SSI_A4: X1.21
SSI_A5: X1.22
SSI_B0: X1.105
SSI_B1: X1.104
SSI_B2: X1.103
SSI_B3: X1.102
SSI_B4: X1.101
SSI_B5: X1.100

Not connected (* = marked no-connect by the designer): X1 58* 108*

### Buses and harness runs
bus A[0..26]
bus A[0..26] = port A[0..26]
bus ADC[0..9] = port ADC[0..9]
bus CTRL[0..26] = port CTRL[0..26]
bus DAC[0..2] = port DAC[0..2]
bus ETH[0..5] = port ETH[0..5]
bus FPGA[0..57]
bus FPGA[0..57] = port FPGA[0..57]
bus I2C[0..1] = port I2C[0..1]
bus LCD[0..24] = port LCD[0..24]
bus SPI[0..4] = port SPI[0..4]
bus SSI_A[0..5] = port SSI_A[0..5]
bus SSI_B[0..5] = port SSI_B[0..5]

### Notes on the sheet
- 1    LD0_B0
  2    LD2_B2
  3    LD4_B4
  4    LD6_G1
  5    LD8_G3
  6    LD10_G5
  7    LD12_R1
  8    LD14_R3
  9    LSCLK
  10  SPL_SPR
  11  CLS
  12  LP_HSYNC
  13  CONTRAST
  14  SPI_MOSI
  15  SPI_MISO
  16  SPI_SSn
  17  SSI0_RXFS
  18  SSI0_TXFS
  19  SSI0_TXCLK
  20  SSI0_RXCLK
  21  SSI0_RXDAT
  22  SSI0_TXDAT
  23  CLKO
  24  A22
  25  A20
  26  A18
  27  A16
  28  A14
  29  A12
  30  A10
  31  A8
  32  A6
  33  A4
  34  A2
  35  A0
  36  CS1n
  37  IO_L01P_5
  38  IO/VREF_5
  39  IO_L28N_5
  40  IO_L31N_5
  41  IO_L32N_5 / GCLK3
  42  IO_L01P_3 / VRN_3
  43  IO_3
  44  IO_L20N_3
  45  IO_L21N_3
  46  IO_L22N_3
  47  GND
  48  EOCn
  49  REFP
  50  AIN7 / CNVSTn
  51  AIN6 / REFN
  52  AIN5
  53  AIN4
  54  AIN3
  55  AIN2
  56  AIN1
  57  AIN0
  58  NC
  59  AVDD
  60  AGND
- 120  LD1_B1
  119  LD3_B3
  118  LD5_G0
  117  LD7_G2
  116  LD9_G4
  115  LD11_R0
  114  LD13_R2
  113  LD15_R4
  112  LD17_REV
  111  LD19_PS
  110  LD21_FLM_VSYNC
  109  LD23_OE_ACD
  108  NC
  107  SPI_SCLK
  106  SPI_RDY
  105  SSI1_RXFS
  104  SSI1_TXFS
  103  SSI1_TXCLK
  102  SSI1_RXCLK
  101  SSI1_RXDAT
  100  SSI1_TXDAT
  99    GND
  98    GND
  97    A23
  96    A21
  95    A19
  94    A17
  93    A15
  92    A13
  91    A11
  90    A9
  89    A7
  88    A5
  87    A3
  86    A1
  85    I2C_SCL
  84    I2C_SDA
  83   IO_L01N_5
  82   IO_L28P_5
  81   IO_L31P_5
  80   IO_L32P_5 / GCLK2
  79   IO_L32N_4 / GCLK1
  78   IO_L01N_3 / VRP_3
  77   IO_L20P_3
  76   IO_L21P_3
  75   IO_L22P_3
  74   IO_L23P_3 / VREF_3
  73   GND
  72   DAC_REF
  71   DAC_OUT1
  70   DAC_OUT2
  69   GND
  68   LINK_ACTn
  67   SPEEDn
  66   TXOn
  65   TXOp
  64   RXIn
  63   RXIp
  62   AVDD
  61   AGND
- Title
- Size:
- Date:
- A4
- Author:
- Revision:
- Sheet
- of
- Armadeus Embedded Solutions
- File:

### Library data of the parts
X1 = FX8-120P: as X2 on sheet APM9328_CONNECTORR; Distributor: Digiley; Price_100: 2,25; Price_500: 1,688; Price_1000: 1,625

## Sheet APD9328_TOP.SchDoc: PERIPH TOP
size A4; Author: NC; Revision: 1.0; SheetNumber: 9; SheetTotal: 14
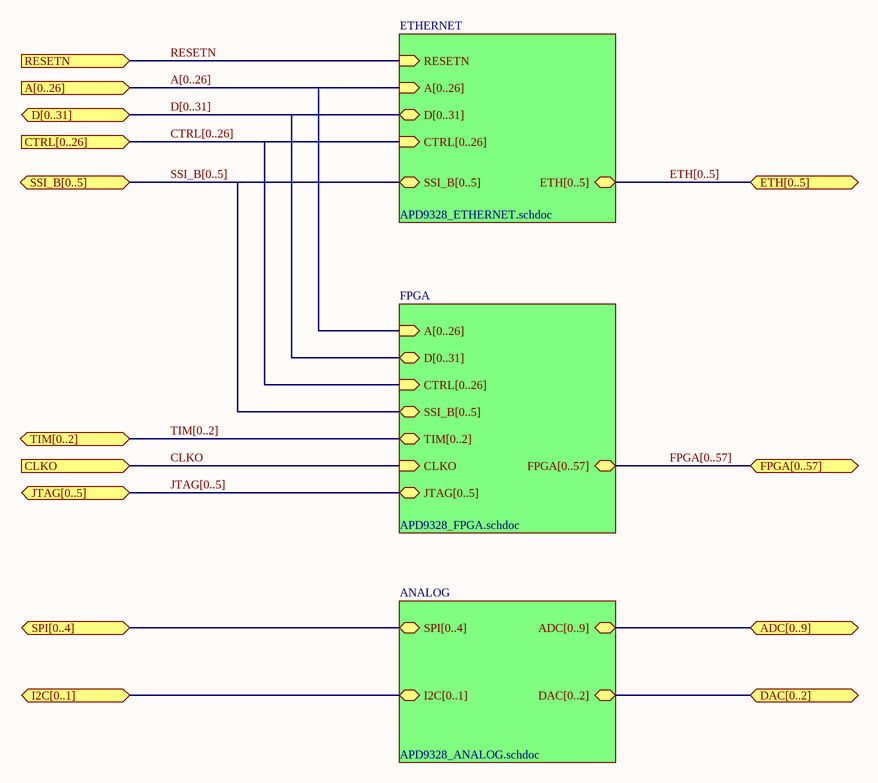
[diagram p7: APD9328_TOP.SchDoc]

### Sub-sheets
ANALOG = APD9328_ANALOG.schdoc: ADC[0..9] (bidir), DAC[0..2] (bidir), SPI[0..4] (bidir), I2C[0..1] (bidir)
ETHERNET = APD9328_ETHERNET.schdoc (file not in this document): A[0..26] (in), D[0..31] (bidir), CTRL[0..26] (in), ETH[0..5] (bidir), RESETN (in), SSI_B[0..5] (bidir)
FPGA = APD9328_FPGA.schdoc: A[0..26] (in), D[0..31] (bidir), CTRL[0..26] (in), FPGA[0..57] (bidir), CLKO (in), SSI_B[0..5] (bidir), TIM[0..2] (bidir), JTAG[0..5] (bidir)

### Ports
A[0..26] (in), ADC[0..9] (bidir), CLKO (in), CTRL[0..26] (in), D[0..31] (bidir), DAC[0..2] (bidir), ETH[0..5] (bidir), FPGA[0..57] (bidir), I2C[0..1] (bidir), JTAG[0..5] (bidir), RESETN (in), SPI[0..4] (bidir), SSI_B[0..5] (bidir), TIM[0..2] (bidir)

### Nets
CLKO: port CLKO, sheet FPGA/CLKO
RESETN: port RESETN, sheet ETHERNET/RESETN

### Buses and harness runs
bus A[0..26] = port A[0..26] = sheet ETHERNET/A[0..26] = sheet FPGA/A[0..26]
bus CTRL[0..26] = port CTRL[0..26] = sheet ETHERNET/CTRL[0..26] = sheet FPGA/CTRL[0..26]
bus D[0..31] = port D[0..31] = sheet ETHERNET/D[0..31] = sheet FPGA/D[0..31]
bus ETH[0..5] = port ETH[0..5] = sheet ETHERNET/ETH[0..5]
bus FPGA[0..57] = port FPGA[0..57] = sheet FPGA/FPGA[0..57]
bus JTAG[0..5] = port JTAG[0..5] = sheet FPGA/JTAG[0..5]
bus port ADC[0..9] = sheet ANALOG/ADC[0..9]
bus port DAC[0..2] = sheet ANALOG/DAC[0..2]
bus port I2C[0..1] = sheet ANALOG/I2C[0..1]
bus port SPI[0..4] = sheet ANALOG/SPI[0..4]
bus SSI_B[0..5] = port SSI_B[0..5] = sheet ETHERNET/SSI_B[0..5] = sheet FPGA/SSI_B[0..5]
bus TIM[0..2] = port TIM[0..2] = sheet FPGA/TIM[0..2]

### Notes on the sheet
- Title
- Size:
- Date:
- A4
- Author:
- Revision:
- Sheet
- of
- Armadeus Embedded Solutions
- File:

## Sheet APD9328_FPGA.SchDoc: FPGA TOP
size A4; Author: NC; Revision: 1.0; SheetNumber: 12; SheetTotal: 14
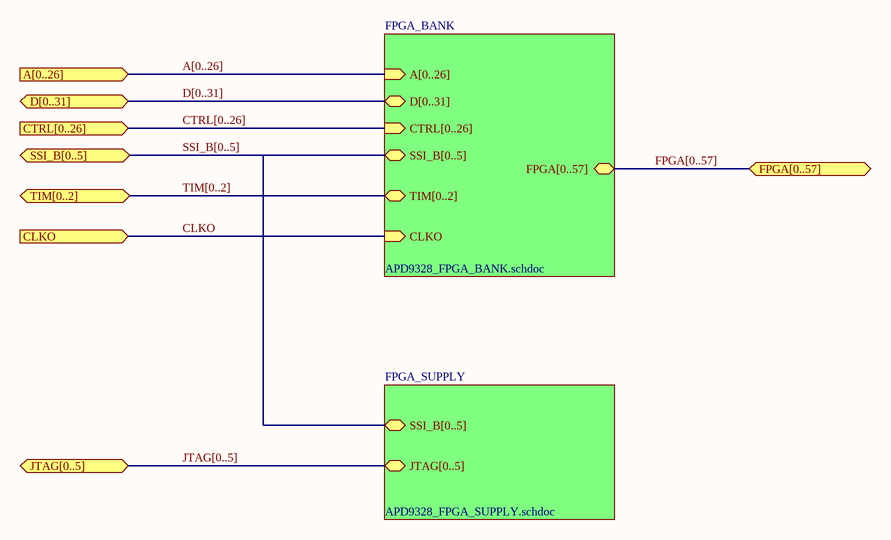
[diagram p8: APD9328_FPGA.SchDoc]

### Sub-sheets
FPGA_BANK = APD9328_FPGA_BANK.schdoc (file not in this document): A[0..26] (in), D[0..31] (bidir), CTRL[0..26] (in), CLKO (in), FPGA[0..57] (bidir), SSI_B[0..5] (bidir), TIM[0..2] (bidir)
FPGA_SUPPLY = APD9328_FPGA_SUPPLY.schdoc (file not in this document): SSI_B[0..5] (bidir), JTAG[0..5] (bidir)

### Ports
A[0..26] (in), CLKO (in), CTRL[0..26] (in), D[0..31] (bidir), FPGA[0..57] (bidir), JTAG[0..5] (bidir), SSI_B[0..5] (bidir), TIM[0..2] (bidir)

### Nets
CLKO: port CLKO, sheet FPGA_BANK/CLKO

### Buses and harness runs
bus A[0..26] = port A[0..26] = sheet FPGA_BANK/A[0..26]
bus CTRL[0..26] = port CTRL[0..26] = sheet FPGA_BANK/CTRL[0..26]
bus D[0..31] = port D[0..31] = sheet FPGA_BANK/D[0..31]
bus FPGA[0..57] = port FPGA[0..57] = sheet FPGA_BANK/FPGA[0..57]
bus JTAG[0..5] = port JTAG[0..5] = sheet FPGA_SUPPLY/JTAG[0..5]
bus SSI_B[0..5] = port SSI_B[0..5] = sheet FPGA_BANK/SSI_B[0..5] = sheet FPGA_SUPPLY/SSI_B[0..5]
bus TIM[0..2] = port TIM[0..2] = sheet FPGA_BANK/TIM[0..2]

### Notes on the sheet
- Title
- Size:
- Date:
- A4
- Author:
- Revision:
- Sheet
- of
- Armadeus Embedded Solutions
- File:

## Sheet APD9328_ANALOG.SchDoc: ANALOG
size A4; Author: NC; Revision: 1.0; SheetNumber: 11; SheetTotal: 14
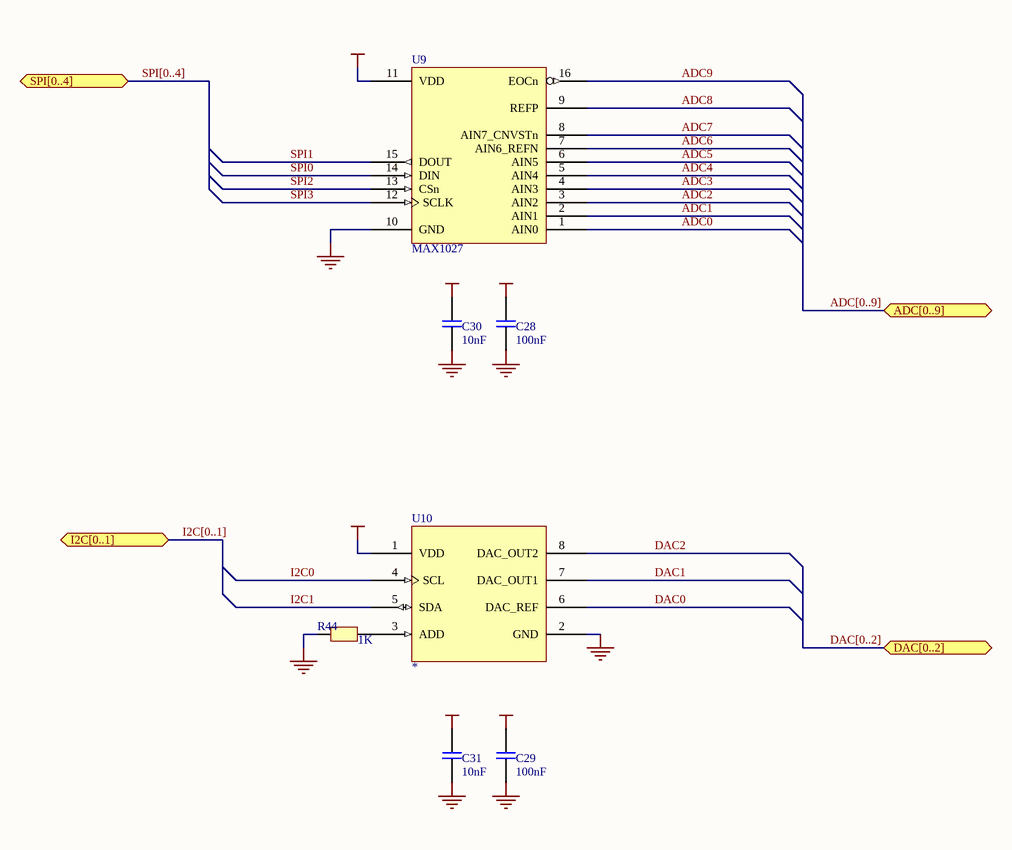
[diagram p9: APD9328_ANALOG.SchDoc]

### Parts
C28  100nF  [0402]
C29  100nF  [0402]
C30  10nF  [0402]
C31  10nF  [0402]
R44  1K  [0402]
U9  MAX1027  [QSOP16]
U10  *

### Ports
ADC[0..9] (bidir), DAC[0..2] (bidir), I2C[0..1] (bidir), SPI[0..4] (bidir)

### Nets
+3V3: C28.2 C29.2 C30.2 C31.2 U9.11(VDD) U10.1(VDD)
GND: C28.1 C29.1 C30.1 C31.1 R44.1 U9.10(GND) U10.2(GND)
ADC0: U9.1(AIN0)
ADC1: U9.2(AIN1)
ADC2: U9.3(AIN2)
ADC3: U9.4(AIN3)
ADC4: U9.5(AIN4)
ADC5: U9.6(AIN5)
ADC6: U9.7(AIN6_REFN)
ADC7: U9.8(AIN7_CNVSTn)
ADC8: U9.9(REFP)
ADC9: U9.16(EOCn)
DAC0: U10.6(DAC_REF)
DAC1: U10.7(DAC_OUT1)
DAC2: U10.8(DAC_OUT2)
I2C0: U10.4(SCL)
I2C1: U10.5(SDA)
SPI0: U9.14(DIN)
SPI1: U9.15(DOUT)
SPI2: U9.13(CSn)
SPI3: U9.12(SCLK)
NetR44_2: R44.2 U10.3(ADD)

### Buses and harness runs
bus ADC[0..9] = port ADC[0..9]
bus DAC[0..2] = port DAC[0..2]
bus I2C[0..1] = port I2C[0..1]
bus SPI[0..4] = port SPI[0..4]

### Notes on the sheet
- Title
- Size:
- Date:
- A4
- Author:
- Revision:
- Sheet
- of
- Armadeus Embedded Solutions
- File:

### Library data of the parts
C28-C31 = Cap: Assembly Option: A
R44 = Res: Assembly Option: A
U9 = MAX1027: ADC serial converter; Manufacturer: Maxim; Part Number: MAX1027-BCCE; Assembly Option: A; Distributor: Maxim; Price_100: 4,25; Price_500: 3,83; Price_1000: 3,46
U10 = MAX5821

## Nets that join several sheets
+1V8: APM9328_PS_Reset (C25.2 C26.2 L1.2), APM9328_CPU (6 pins)
+3V3: APM9328_PS_Reset (8 pins), APM9328_CPU (23 pins), APM9328_PERIPH (8 pins), APM9328_CONNECTORR (X2.57 X2.58 X2.63 X2.64), APD9328_ANALOG (6 pins)
GND: APM9328_PS_Reset (10 pins), APM9328_CPU (31 pins), APM9328_PERIPH (8 pins), APM9328_CONNECTORR (8 pins), APM9328_CONNECTORL (5 pins), APD9328_ANALOG (7 pins)
A0: APM9328_CPU (U1.R7), APM9328_CONNECTORL (X1.35)
A1: APM9328_CPU (U1.P6), APM9328_CONNECTORL (X1.86)
A2: APM9328_CPU (U1.P5), APM9328_CONNECTORL (X1.34)
A3: APM9328_CPU (U1.P4), APM9328_CONNECTORL (X1.87)
A4: APM9328_CPU (U1.P3), APM9328_CONNECTORL (X1.33)
A5: APM9328_CPU (U1.P2), APM9328_CONNECTORL (X1.88)
A6: APM9328_CPU (U1.R1), APM9328_CONNECTORL (X1.32)
A7: APM9328_CPU (U1.N2), APM9328_CONNECTORL (X1.89)
A8: APM9328_CPU (U1.N1), APM9328_CONNECTORL (X1.31)
A9: APM9328_CPU (U1.L2), APM9328_CONNECTORL (X1.90)
A10: APM9328_CPU (U1.L1), APM9328_CONNECTORL (X1.30)
A11: APM9328_CPU (U1.K2), APM9328_CONNECTORL (X1.91)
A12: APM9328_CPU (U1.J2), APM9328_CONNECTORL (X1.29)
A13: APM9328_CPU (U1.K1), APM9328_CONNECTORL (X1.92)
A14: APM9328_CPU (U1.J1), APM9328_CONNECTORL (X1.28)
A15: APM9328_CPU (U1.H1), APM9328_CONNECTORL (X1.93)
A16: APM9328_CPU (U1.H2), APM9328_CONNECTORL (X1.27)
A17: APM9328_CPU (U1.G1), APM9328_CONNECTORL (X1.94)
A18: APM9328_CPU (U1.G2), APM9328_CONNECTORL (X1.26)
A19: APM9328_CPU (U1.F2), APM9328_CONNECTORL (X1.95)
A20: APM9328_CPU (U1.F1), APM9328_CONNECTORL (X1.25)
A21: APM9328_CPU (U1.E1), APM9328_CONNECTORL (X1.96)
A22: APM9328_CPU (U1.E2), APM9328_CONNECTORL (X1.24)
A23: APM9328_CPU (U1.D1), APM9328_CONNECTORL (X1.97)
ADC0: APM9328_CONNECTORL (X1.57), APD9328_ANALOG (U9.1)
ADC1: APM9328_CONNECTORL (X1.56), APD9328_ANALOG (U9.2)
ADC2: APM9328_CONNECTORL (X1.55), APD9328_ANALOG (U9.3)
ADC3: APM9328_CONNECTORL (X1.54), APD9328_ANALOG (U9.4)
ADC4: APM9328_CONNECTORL (X1.53), APD9328_ANALOG (U9.5)
ADC5: APM9328_CONNECTORL (X1.52), APD9328_ANALOG (U9.6)
ADC6: APM9328_CONNECTORL (X1.51), APD9328_ANALOG (U9.7)
ADC7: APM9328_CONNECTORL (X1.50), APD9328_ANALOG (U9.8)
ADC8: APM9328_CONNECTORL (X1.49), APD9328_ANALOG (U9.9)
ADC9: APM9328_CONNECTORL (X1.48), APD9328_ANALOG (U9.16)
BOOT: APM9328_CPU (R1.1 U1.J15 U1.K11), APM9328_CONNECTORR (X2.119)
CLKO: APM9328_CPU (R8.2), APM9328_CONNECTORL (X1.23)
CSI0: APM9328_CPU (U1.E14), APM9328_CONNECTORR (X2.1)
CSI1: APM9328_CPU (U1.H11), APM9328_CONNECTORR (X2.2)
CSI2: APM9328_CPU (U1.F14), APM9328_CONNECTORR (X2.3)
CSI3: APM9328_CPU (U1.G12), APM9328_CONNECTORR (X2.4)
CSI4: APM9328_CPU (U1.F15), APM9328_CONNECTORR (X2.5)
CSI5: APM9328_CPU (U1.G15), APM9328_CONNECTORR (X2.6)
CSI6: APM9328_CPU (U1.J10), APM9328_CONNECTORR (X2.7)
CSI7: APM9328_CPU (U1.G13), APM9328_CONNECTORR (X2.8)
CSI8: APM9328_CPU (U1.H13), APM9328_CONNECTORR (X2.9)
CSI9: APM9328_CPU (U1.G14), APM9328_CONNECTORR (X2.10)
CSI10: APM9328_CPU (U1.H12), APM9328_CONNECTORR (X2.11)
CSI11: APM9328_CPU (U1.E15), APM9328_CONNECTORR (X2.12)
CTRL1: APM9328_CPU (U1.M8), APM9328_CONNECTORL (X1.36)
CTRL3: APM9328_CPU (U1.N7), APM9328_CONNECTORR (X2.26)
CTRL4: APM9328_CPU (U1.M7), APM9328_CONNECTORR (X2.25)
CTRL5: APM9328_CPU (U1.L7), APM9328_CONNECTORR (X2.24)
CTRL8: APM9328_CPU (U1.R4), APM9328_CONNECTORR (X2.23)
CTRL9: APM9328_CPU (U1.M5), APM9328_CONNECTORR (X2.95)
CTRL10: APM9328_CPU (U1.R5), APM9328_CONNECTORR (X2.96)
CTRL11: APM9328_CPU (U1.M10), APM9328_CONNECTORR (X2.97)
CTRL13: APM9328_CPU (U1.N9), APM9328_CONNECTORR (X2.98)
D0: APM9328_CPU (U1.N10), APM9328_CONNECTORR (X2.86)
D1: APM9328_CPU (U1.K10), APM9328_CONNECTORR (X2.87)
D2: APM9328_CPU (U1.L8), APM9328_CONNECTORR (X2.88)
D3: APM9328_CPU (U1.R11), APM9328_CONNECTORR (X2.89)
D4: APM9328_CPU (U1.R9), APM9328_CONNECTORR (X2.90)
D5: APM9328_CPU (U1.P8), APM9328_CONNECTORR (X2.91)
D6: APM9328_CPU (U1.P7), APM9328_CONNECTORR (X2.92)
D7: APM9328_CPU (U1.R6), APM9328_CONNECTORR (X2.93)
D8: APM9328_CPU (U1.N6), APM9328_CONNECTORR (X2.35)
D9: APM9328_CPU (U1.N5), APM9328_CONNECTORR (X2.34)
D10: APM9328_CPU (U1.M4), APM9328_CONNECTORR (X2.33)
D11: APM9328_CPU (U1.R2), APM9328_CONNECTORR (X2.32)
D12: APM9328_CPU (U1.N3), APM9328_CONNECTORR (X2.31)
D13: APM9328_CPU (U1.M3), APM9328_CONNECTORR (X2.30)
D14: APM9328_CPU (U1.P1), APM9328_CONNECTORR (X2.29)
D15: APM9328_CPU (U1.M2), APM9328_CONNECTORR (X2.28)
DAC0: APM9328_CONNECTORL (X1.70), APD9328_ANALOG (U10.6)
DAC1: APM9328_CONNECTORL (X1.71), APD9328_ANALOG (U10.7)
DAC2: APM9328_CONNECTORL (X1.72), APD9328_ANALOG (U10.8)
EXTAL16M: APM9328_CPU (R9.2), APM9328_CONNECTORR (X2.117)
I2C0: APM9328_CPU (R6.1 U1.J11), APM9328_CONNECTORL (X1.85), APD9328_ANALOG (U10.4)
I2C1: APM9328_CPU (R7.1 U1.H14), APM9328_CONNECTORL (X1.84), APD9328_ANALOG (U10.5)
JTAG0: APM9328_CPU (U1.J12), APM9328_CONNECTORR (X2.116)
JTAG1: APM9328_CPU (U1.H15), APM9328_CONNECTORR (X2.115)
JTAG2: APM9328_CPU (U1.K12), APM9328_CONNECTORR (X2.114)
JTAG4: APM9328_CPU (U1.N15), APM9328_CONNECTORR (X2.112)
LCD0: APM9328_CPU (U1.B12), APM9328_CONNECTORL (X1.1)
LCD1: APM9328_CPU (U1.D12), APM9328_CONNECTORL (X1.120)
LCD2: APM9328_CPU (U1.A13), APM9328_CONNECTORL (X1.2)
LCD3: APM9328_CPU (U1.B13), APM9328_CONNECTORL (X1.119)
LCD4: APM9328_CPU (U1.A14), APM9328_CONNECTORL (X1.3)
LCD5: APM9328_CPU (U1.A15), APM9328_CONNECTORL (X1.118)
LCD6: APM9328_CPU (U1.B14), APM9328_CONNECTORL (X1.4)
LCD7: APM9328_CPU (U1.B15), APM9328_CONNECTORL (X1.117)
LCD8: APM9328_CPU (U1.C12), APM9328_CONNECTORL (X1.5)
LCD9: APM9328_CPU (U1.C13), APM9328_CONNECTORL (X1.116)
LCD10: APM9328_CPU (U1.E12), APM9328_CONNECTORL (X1.6)
LCD11: APM9328_CPU (U1.D13), APM9328_CONNECTORL (X1.115)
LCD12: APM9328_CPU (U1.C14), APM9328_CONNECTORL (X1.7)
LCD13: APM9328_CPU (U1.D15), APM9328_CONNECTORL (X1.114)
LCD14: APM9328_CPU (U1.F12), APM9328_CONNECTORL (X1.8)
LCD15: APM9328_CPU (U1.F13), APM9328_CONNECTORL (X1.113)
LCD16: APM9328_CPU (U1.B10), APM9328_CONNECTORL (X1.9)
LCD17: APM9328_CPU (U1.A11), APM9328_CONNECTORL (X1.112)
LCD18: APM9328_CPU (U1.B11), APM9328_CONNECTORL (X1.10)
LCD19: APM9328_CPU (U1.A12), APM9328_CONNECTORL (X1.111)
LCD20: APM9328_CPU (U1.F10), APM9328_CONNECTORL (X1.11)
LCD21: APM9328_CPU (U1.C11), APM9328_CONNECTORL (X1.110)
LCD22: APM9328_CPU (U1.D11), APM9328_CONNECTORL (X1.12)
LCD23: APM9328_CPU (U1.E11), APM9328_CONNECTORL (X1.109)
LCD24: APM9328_CPU (U1.C10), APM9328_CONNECTORL (X1.13)
POR: APM9328_PS_Reset (U6.4), APM9328_CPU (U1.L12)
RESETN: APM9328_PS_Reset (U7.2), APM9328_CPU (U1.M14), APM9328_CONNECTORR (X2.120)
SD0: APM9328_CPU (U1.C2), APM9328_CONNECTORR (X2.16)
SD1: APM9328_CPU (U1.D3), APM9328_CONNECTORR (X2.17)
SD2: APM9328_CPU (U1.C5), APM9328_CONNECTORR (X2.18)
SD3: APM9328_CPU (U1.B1), APM9328_CONNECTORR (X2.19)
SD4: APM9328_CPU (U1.B2), APM9328_CONNECTORR (X2.20)
SD5: APM9328_CPU (U1.A1), APM9328_CONNECTORR (X2.21)
SPI0: APM9328_CPU (U1.D10), APM9328_CONNECTORL (X1.14), APD9328_ANALOG (U9.14)
SPI1: APM9328_CPU (U1.E10), APM9328_CONNECTORL (X1.15), APD9328_ANALOG (U9.15)
SPI2: APM9328_CPU (U1.B9), APM9328_CONNECTORL (X1.16), APD9328_ANALOG (U9.13)
SPI3: APM9328_CPU (U1.A10), APM9328_CONNECTORL (X1.107), APD9328_ANALOG (U9.12)
SPI4: APM9328_CPU (U1.A9), APM9328_CONNECTORL (X1.106)
SSI_A0: APM9328_CPU (U1.A7), APM9328_CONNECTORL (X1.17)
SSI_A1: APM9328_CPU (U1.C8), APM9328_CONNECTORL (X1.18)
SSI_A2: APM9328_CPU (U1.A8), APM9328_CONNECTORL (X1.19)
SSI_A3: APM9328_CPU (U1.F8), APM9328_CONNECTORL (X1.20)
SSI_A4: APM9328_CPU (U1.B7), APM9328_CONNECTORL (X1.21)
SSI_A5: APM9328_CPU (U1.F9), APM9328_CONNECTORL (X1.22)
SSI_B0: APM9328_CPU (U1.C3), APM9328_CONNECTORL (X1.105)
SSI_B1: APM9328_CPU (U1.C4), APM9328_CONNECTORL (X1.104)
SSI_B2: APM9328_CPU (U1.A3), APM9328_CONNECTORL (X1.103)
SSI_B3: APM9328_CPU (U1.A2), APM9328_CONNECTORL (X1.102)
SSI_B4: APM9328_CPU (U1.B3), APM9328_CONNECTORL (X1.101)
SSI_B5: APM9328_CPU (U1.D4), APM9328_CONNECTORL (X1.100)
TIM0: APM9328_CPU (U1.D14), APM9328_CONNECTORR (X2.13)
TIM1: APM9328_CPU (U1.E13), APM9328_CONNECTORR (X2.14)
TIM2: APM9328_CPU (U1.G11), APM9328_CONNECTORR (X2.15)
UART0: APM9328_CPU (U1.E8), APM9328_PERIPH (R48.1 U4.9)
UART1: APM9328_CPU (U1.B8), APM9328_PERIPH (R47.1 U4.11)
UART2: APM9328_CPU (U1.C9), APM9328_CONNECTORR (X2.109)
UART3: APM9328_CPU (U1.E9), APM9328_CONNECTORR (X2.108)
UART4: APM9328_CPU (U1.C7), APM9328_CONNECTORR (X2.107)
UART5: APM9328_CPU (U1.D8), APM9328_CONNECTORR (X2.106)
UART6: APM9328_CPU (U1.E7), APM9328_CONNECTORR (X2.105)
UART7: APM9328_CPU (U1.F7), APM9328_CONNECTORR (X2.104)
USB0: APM9328_CPU (U1.B4), APM9328_PERIPH (U5.2)
USB1: APM9328_CPU (U1.B6), APM9328_PERIPH (U5.14)
USB2: APM9328_CPU (U1.C6), APM9328_PERIPH (U5.13)
USB3: APM9328_CPU (U1.A6), APM9328_PERIPH (U5.6)
USB4: APM9328_CPU (U1.D6), APM9328_PERIPH (U5.5)
USB5: APM9328_CPU (U1.A5), APM9328_PERIPH (U5.7)
USB6: APM9328_CPU (U1.B5), APM9328_PERIPH (U5.4)
USB7: APM9328_CPU (U1.A4), APM9328_PERIPH (U5.3)
USB_OUT0: APM9328_PERIPH (R21.1 R22.2), APM9328_CONNECTORR (X2.101)
USB_OUT1: APM9328_PERIPH (R23.2), APM9328_CONNECTORR (X2.100)